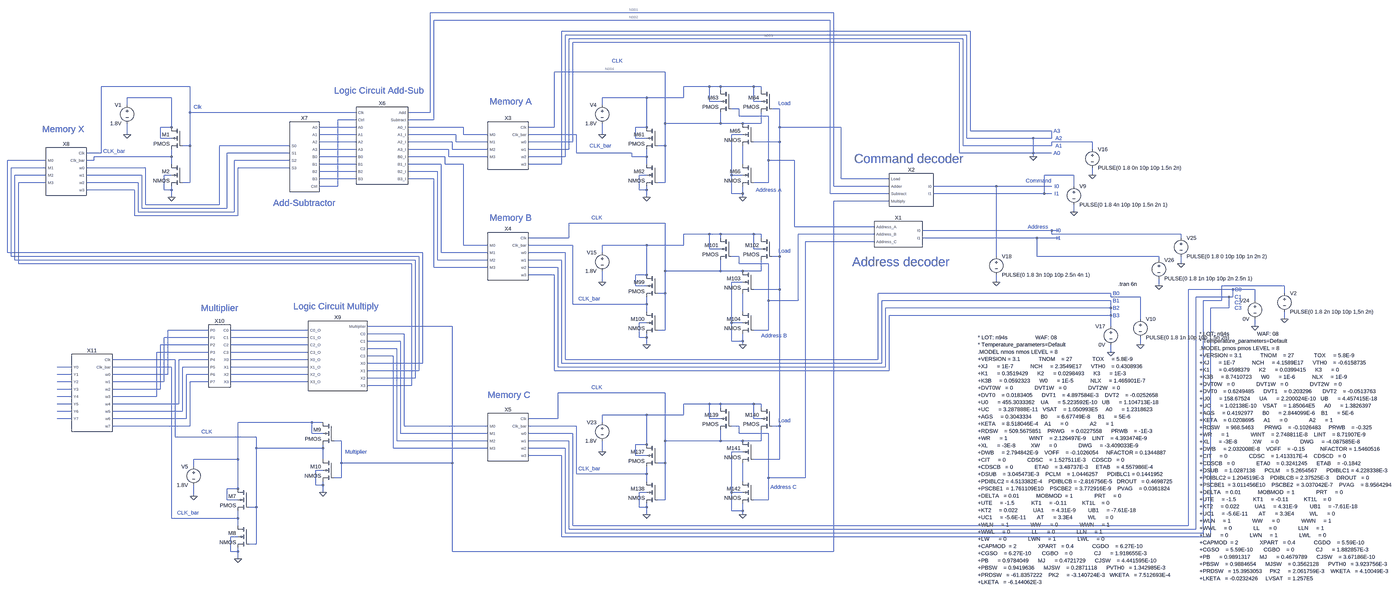
[diagram p0: schematic Ex5_Ex_Multiplier_Working_Simplified.asc, whole sheet]
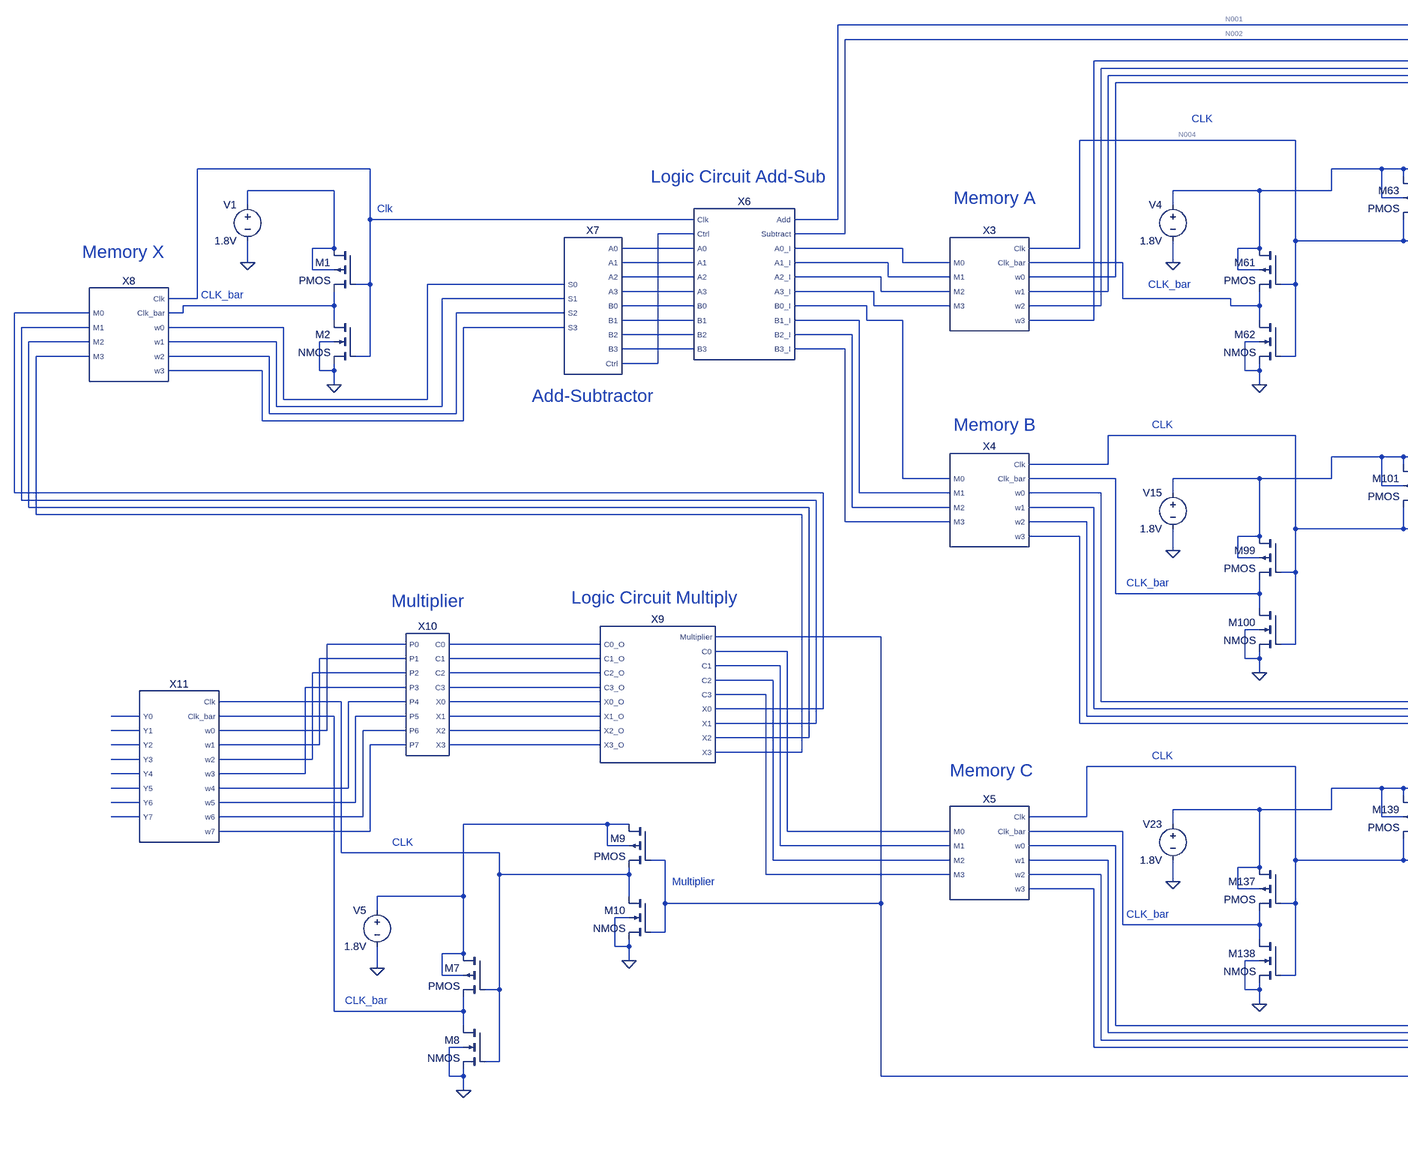
[diagram p1: schematic Ex5_Ex_Multiplier_Working_Simplified.asc, part, row 1 of 1, column 1 of 2]
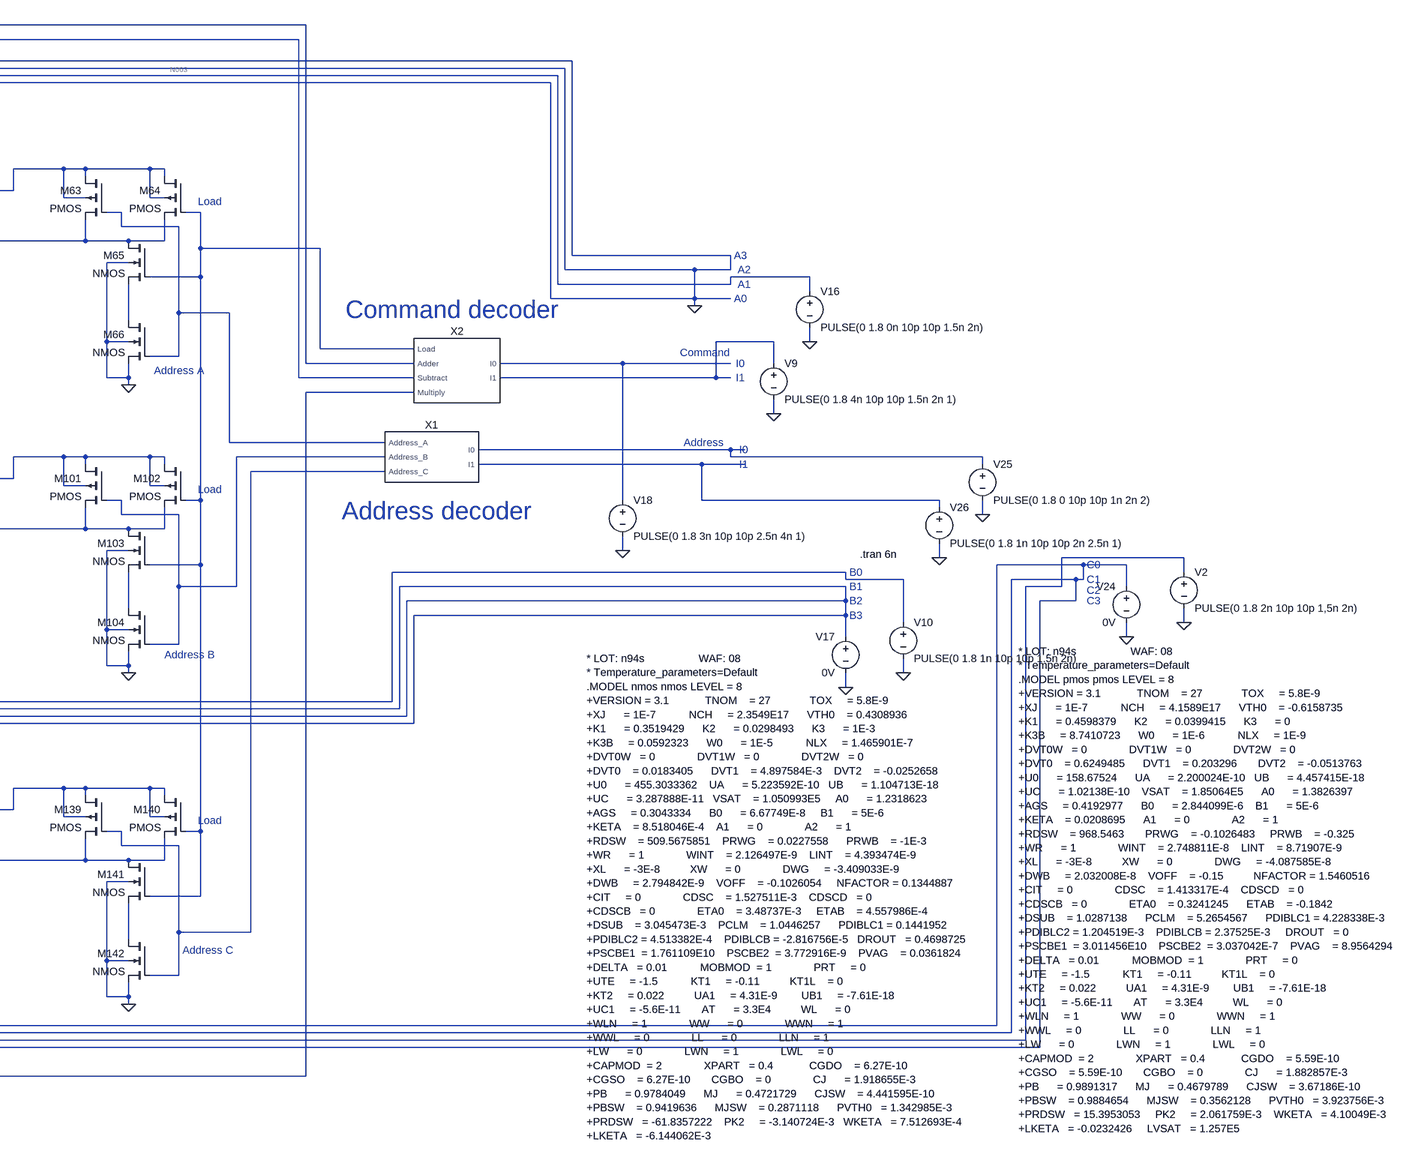
[diagram p2: schematic Ex5_Ex_Multiplier_Working_Simplified.asc, part, row 1 of 1, column 2 of 2]
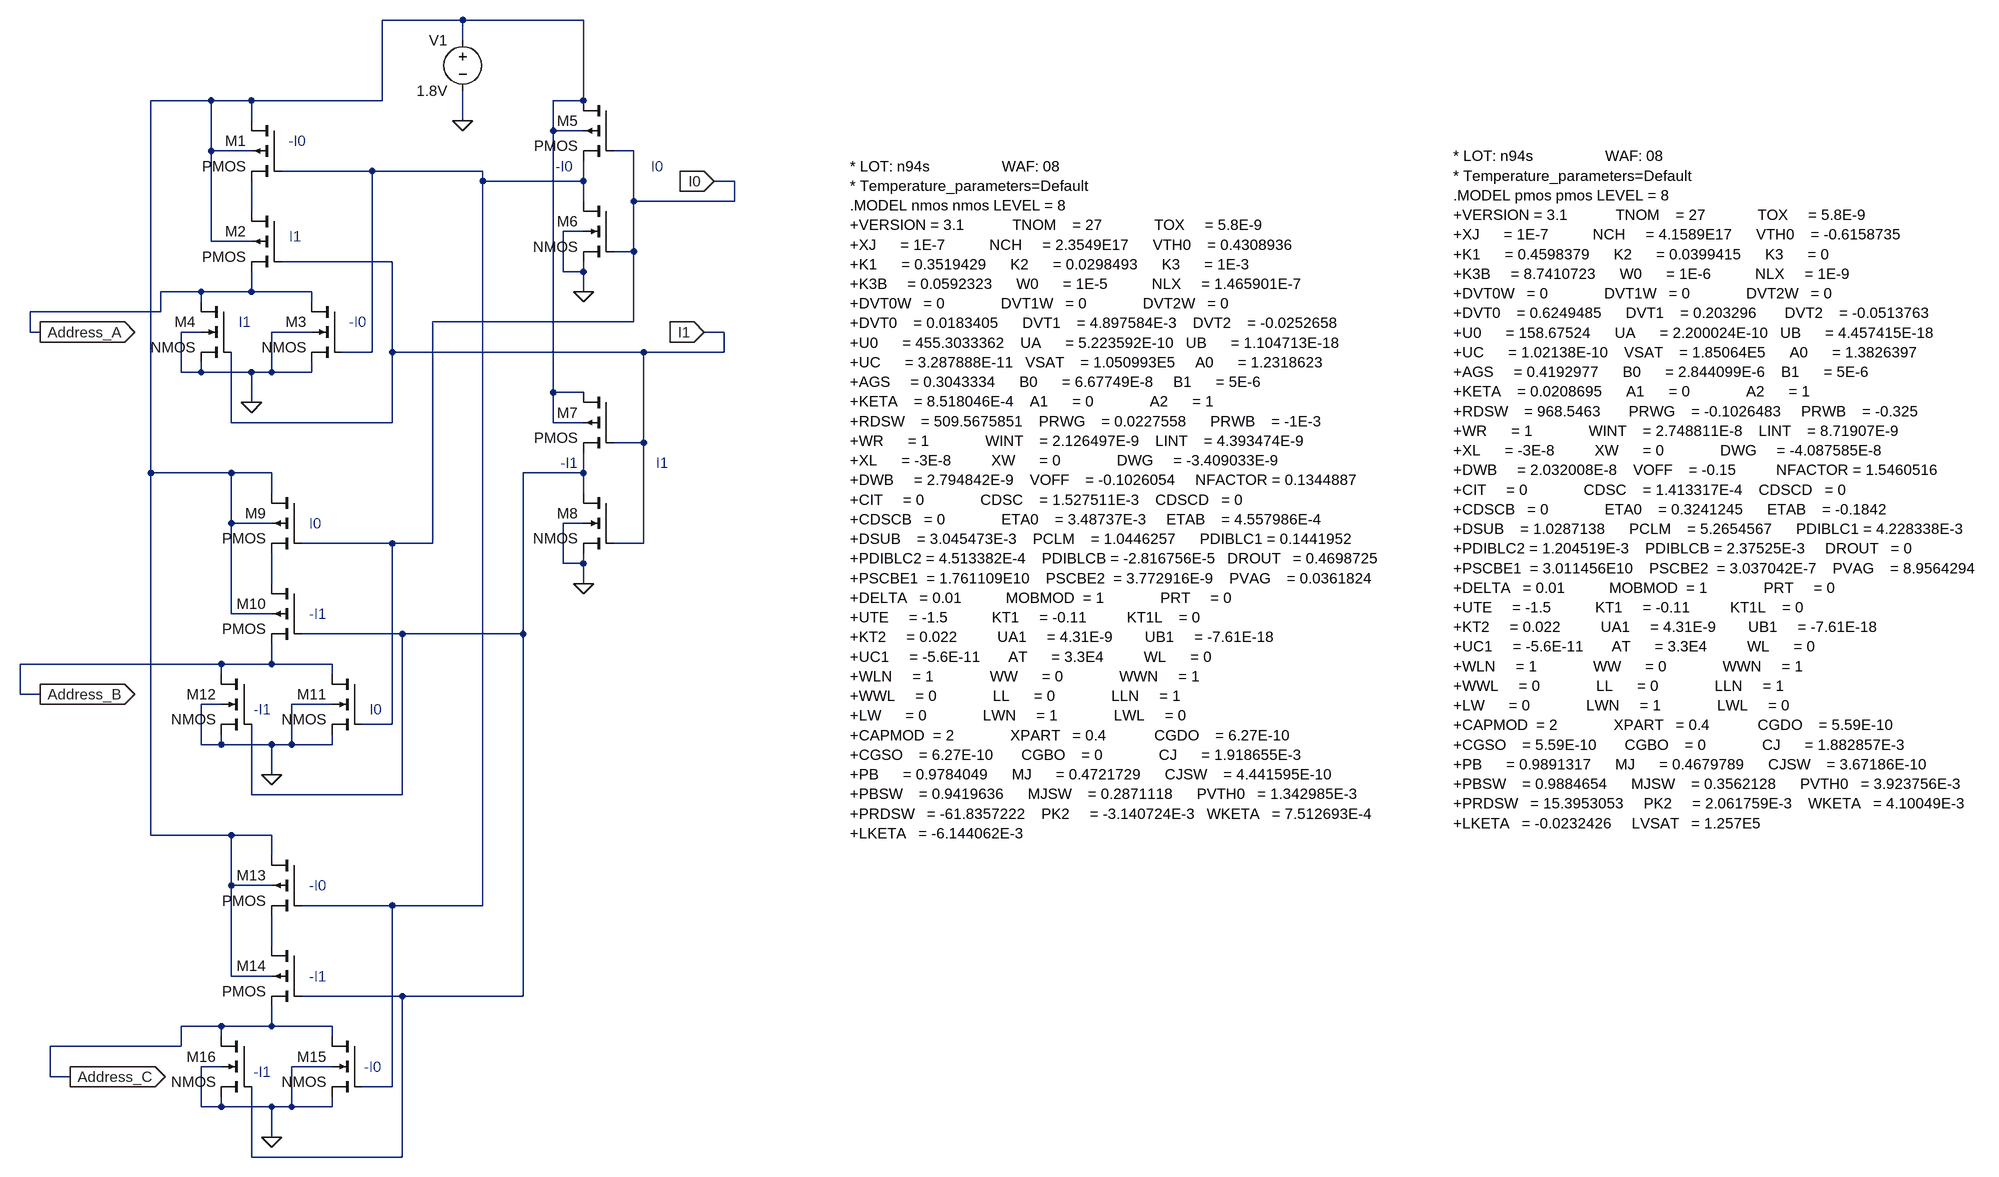
[diagram p3: sub-circuit address_decoder.asc]
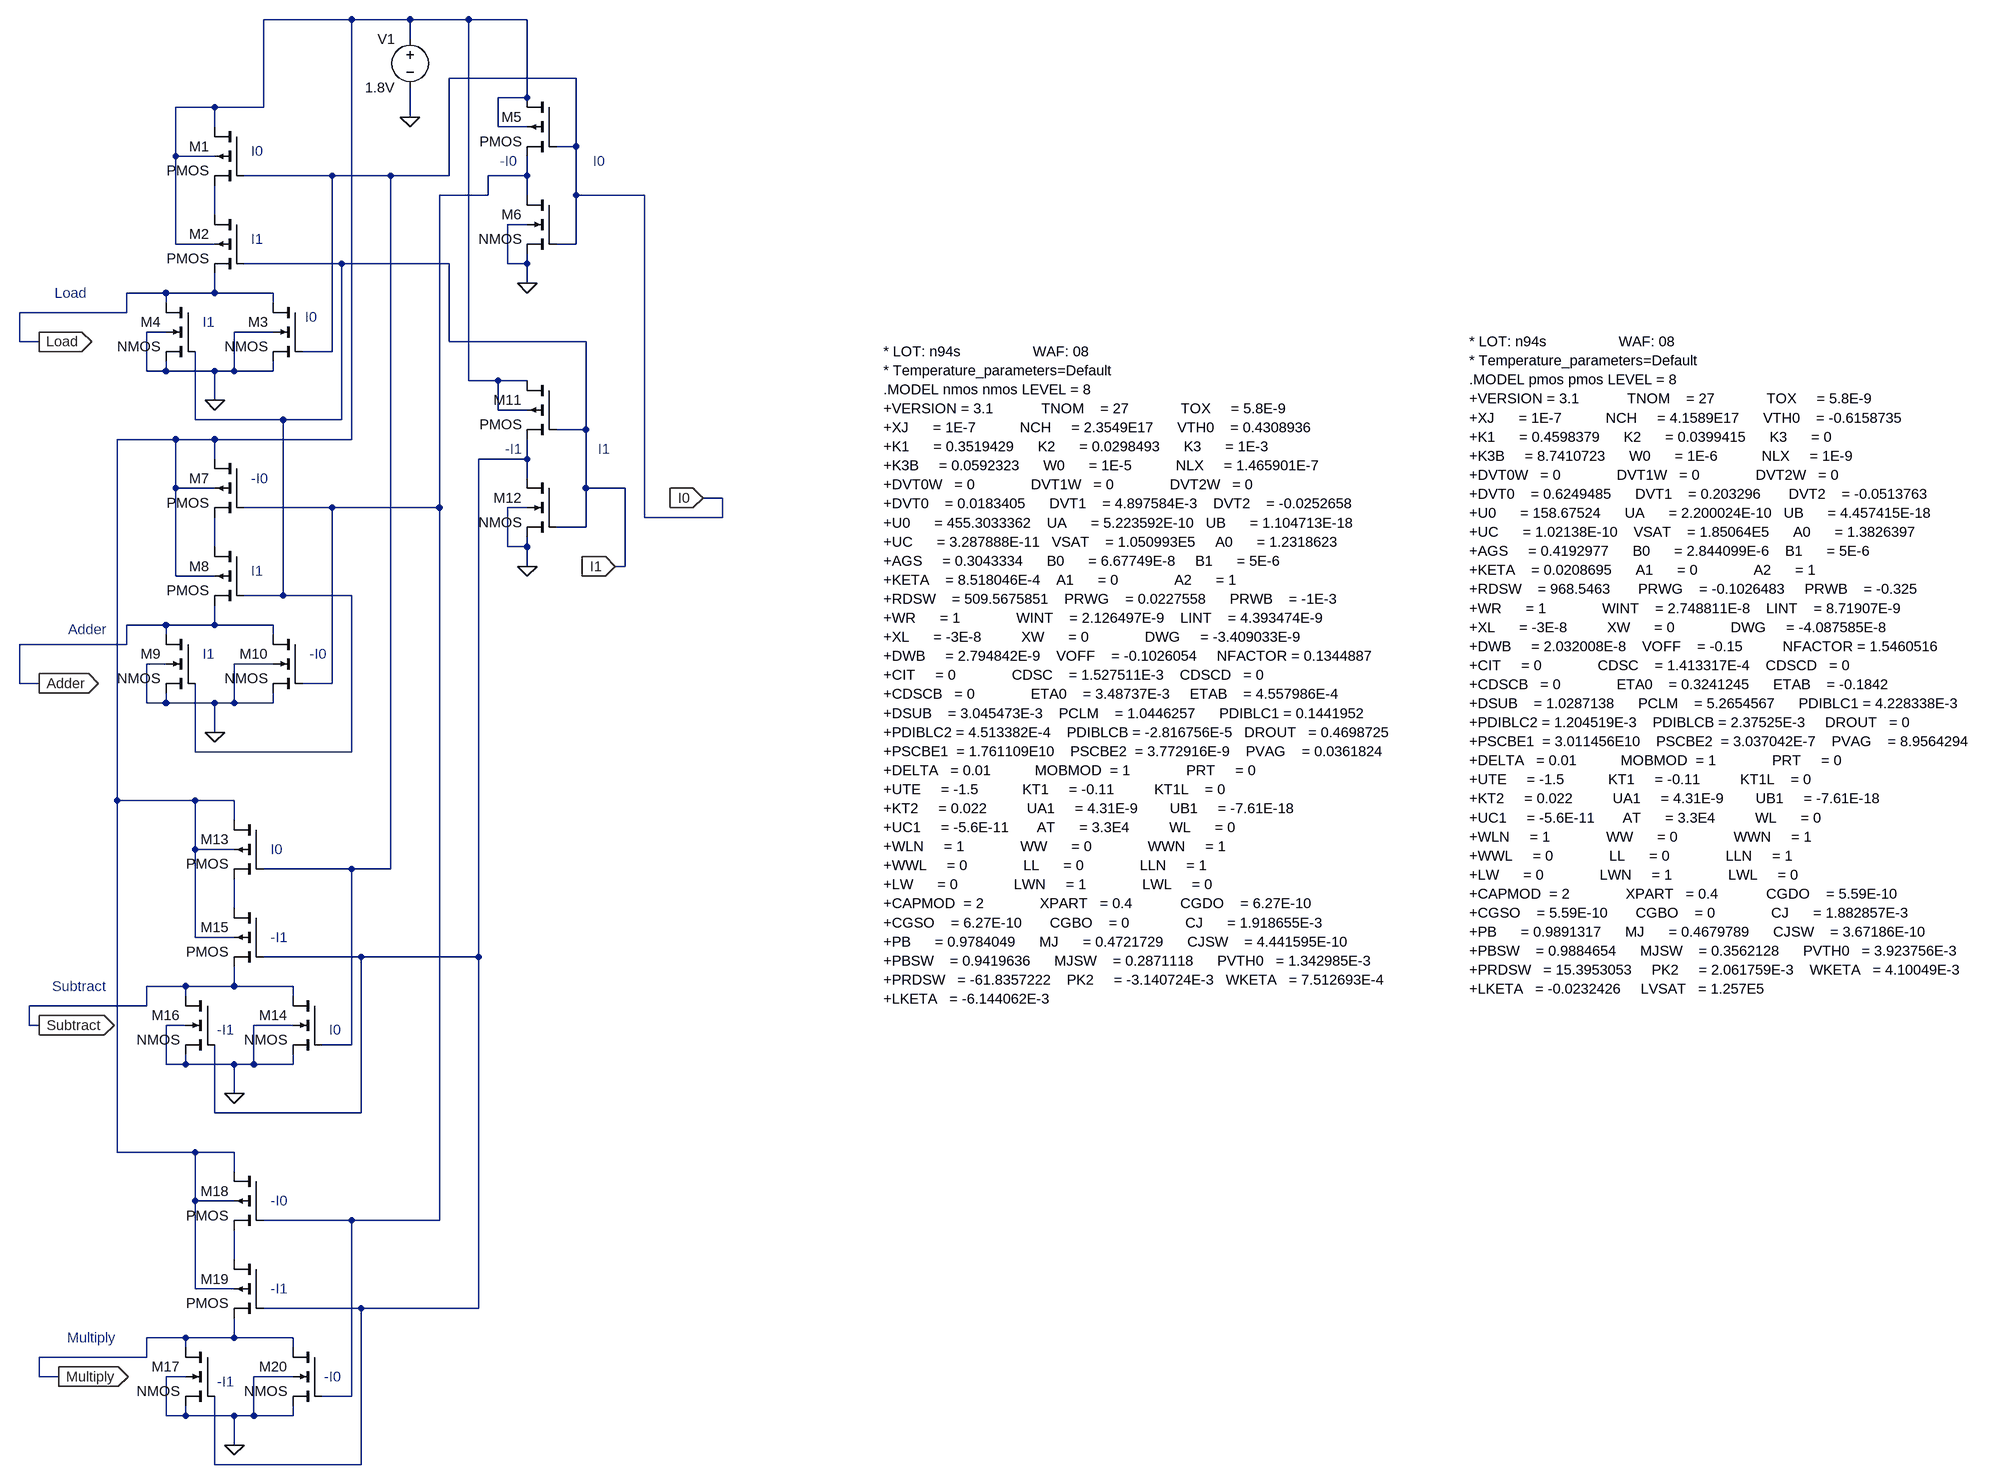
[diagram p4: sub-circuit command_decoder.asc]
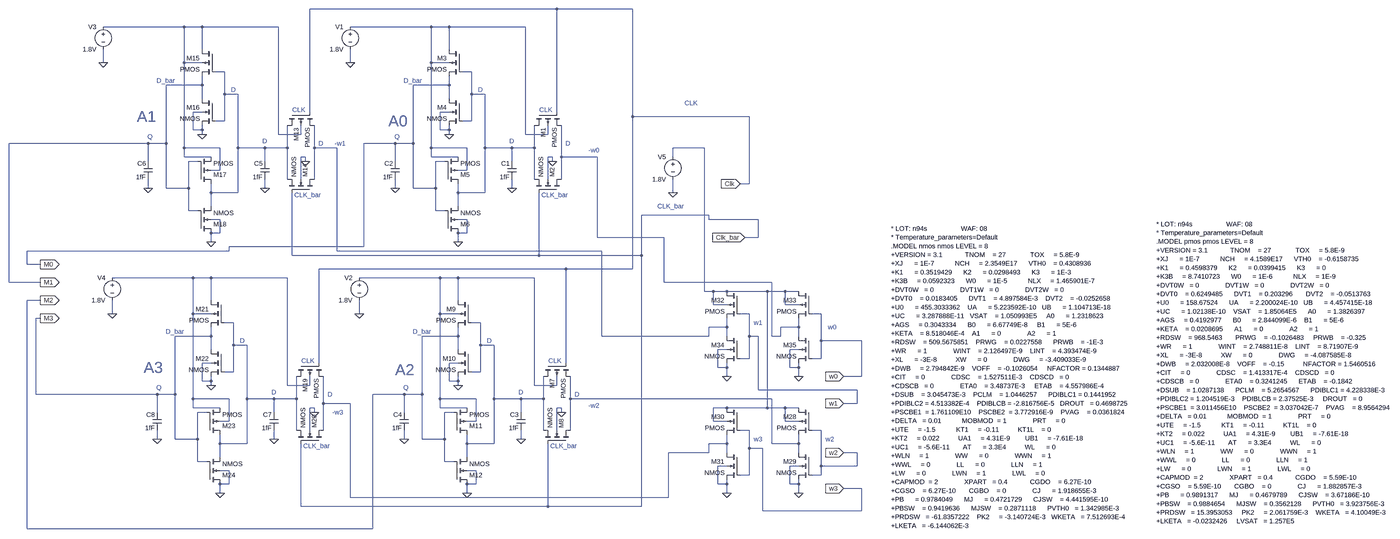
[diagram p5: sub-circuit 4-bit_memory.asc, whole sheet]
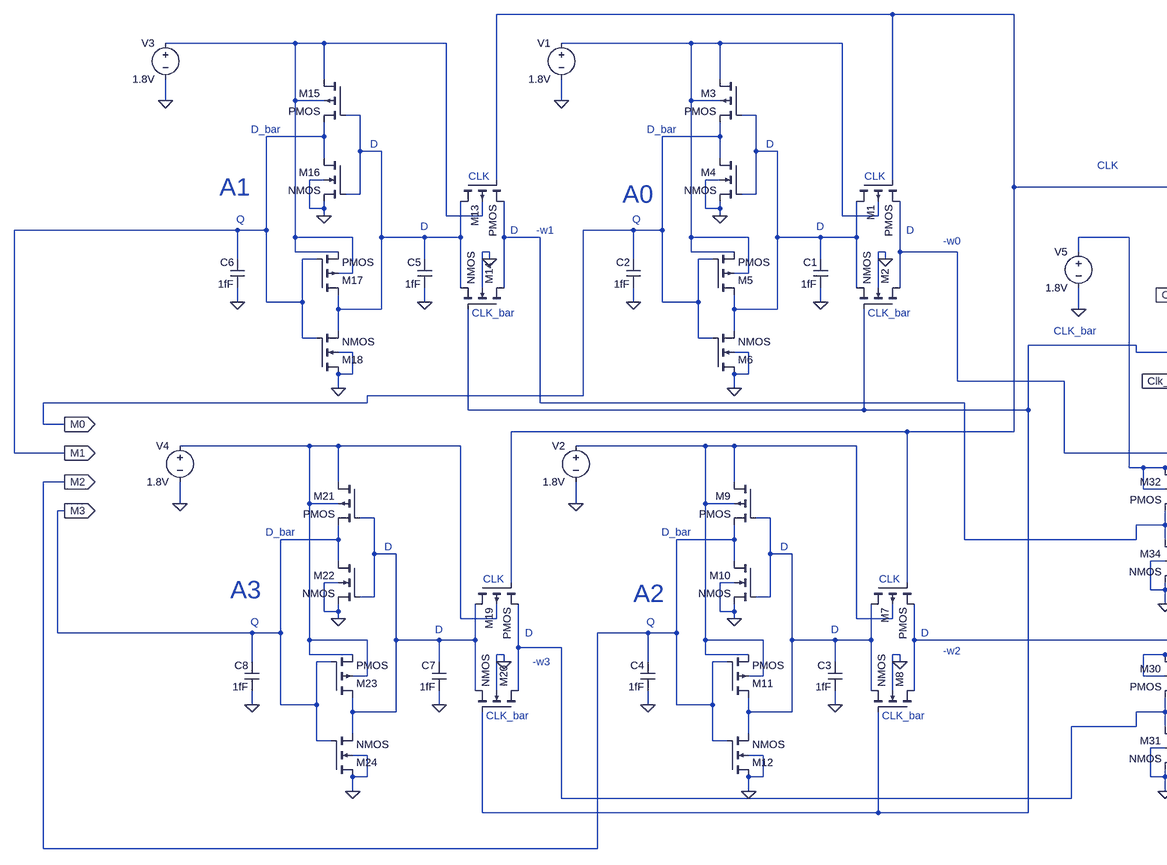
[diagram p6: sub-circuit 4-bit_memory.asc, part, row 1 of 1, column 1 of 2]
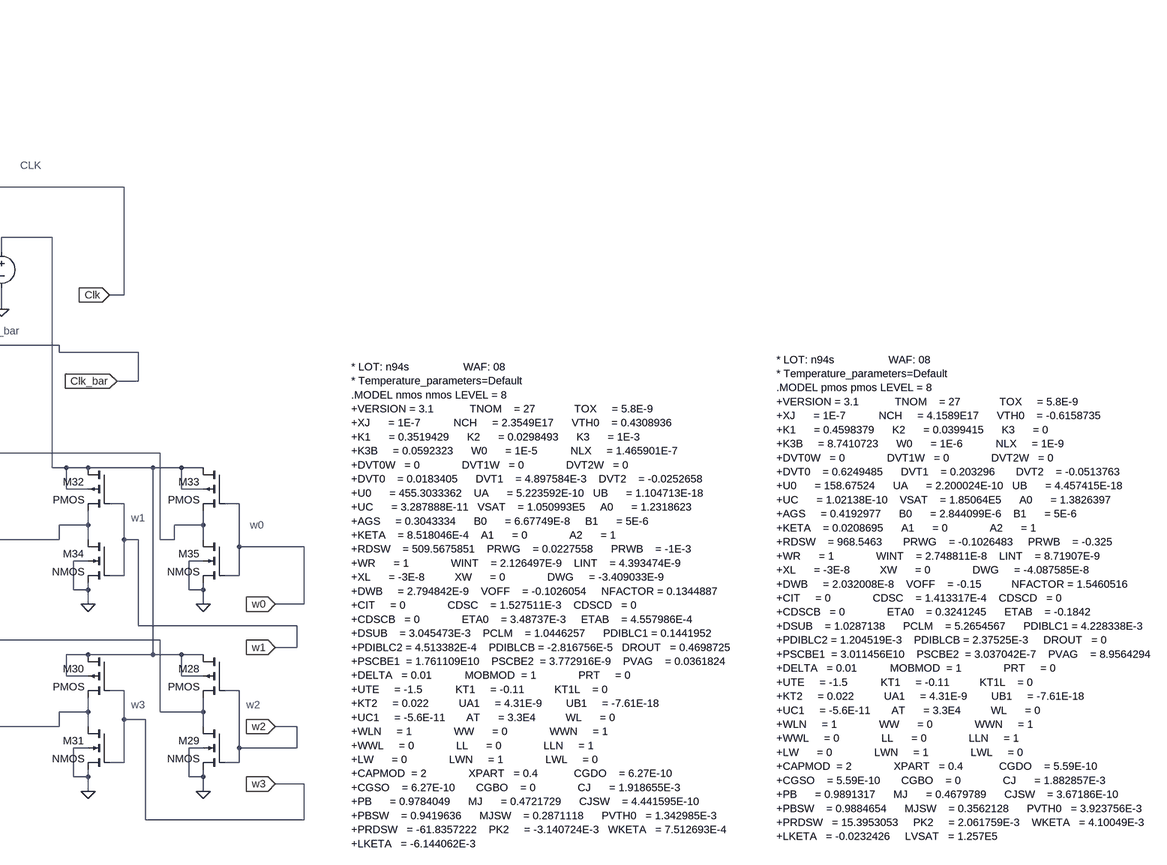
[diagram p7: sub-circuit 4-bit_memory.asc, part, row 1 of 1, column 2 of 2]
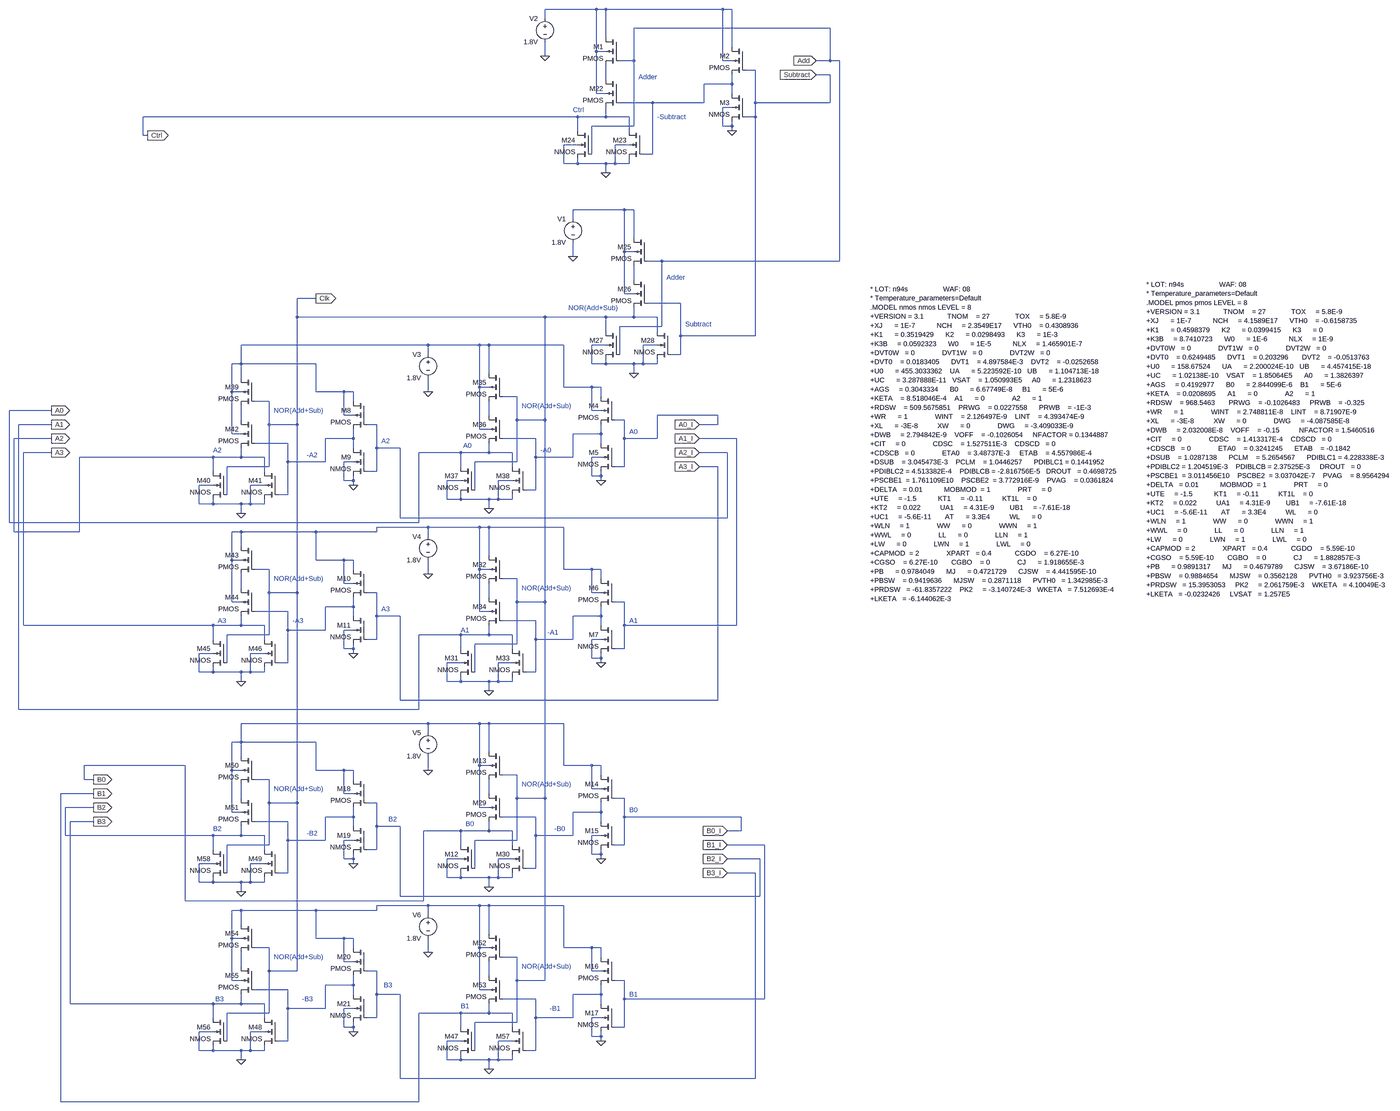
[diagram p8: sub-circuit logic_circuit_add-sub.asc, whole sheet]
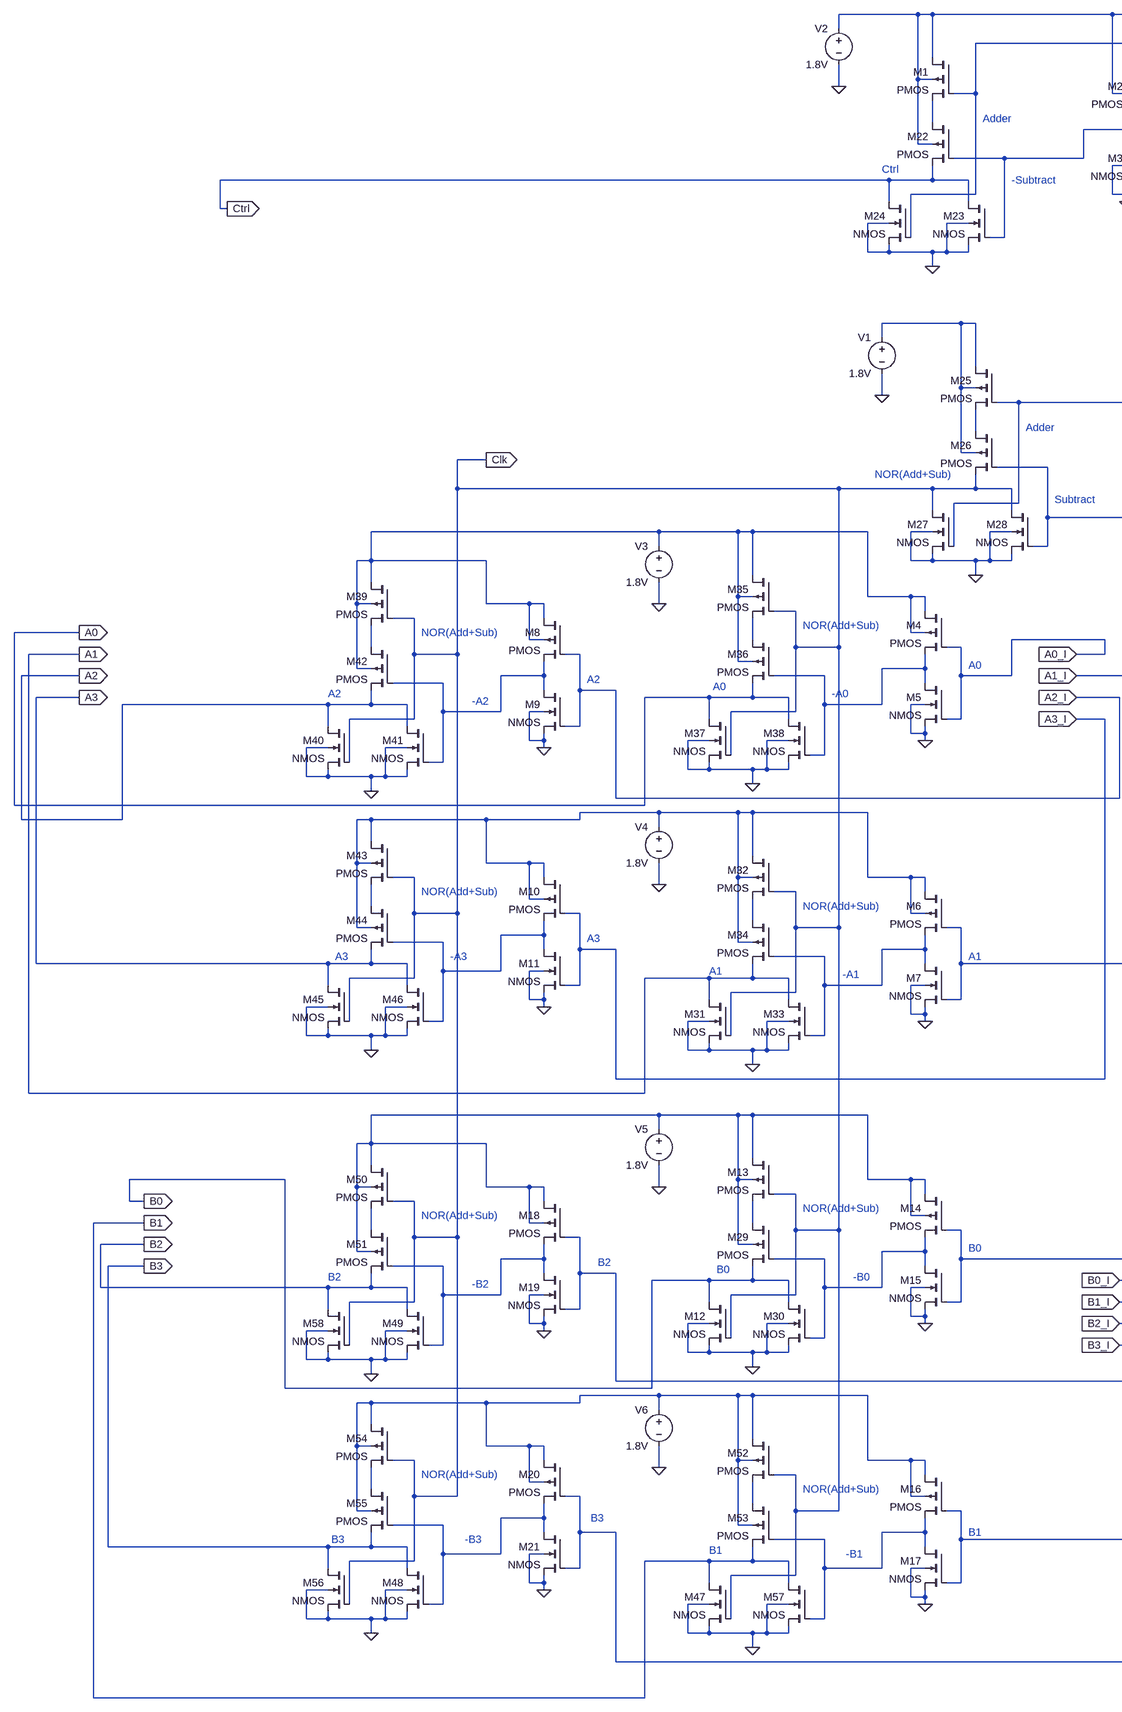
[diagram p9: sub-circuit logic_circuit_add-sub.asc, part, row 1 of 1, column 1 of 2]
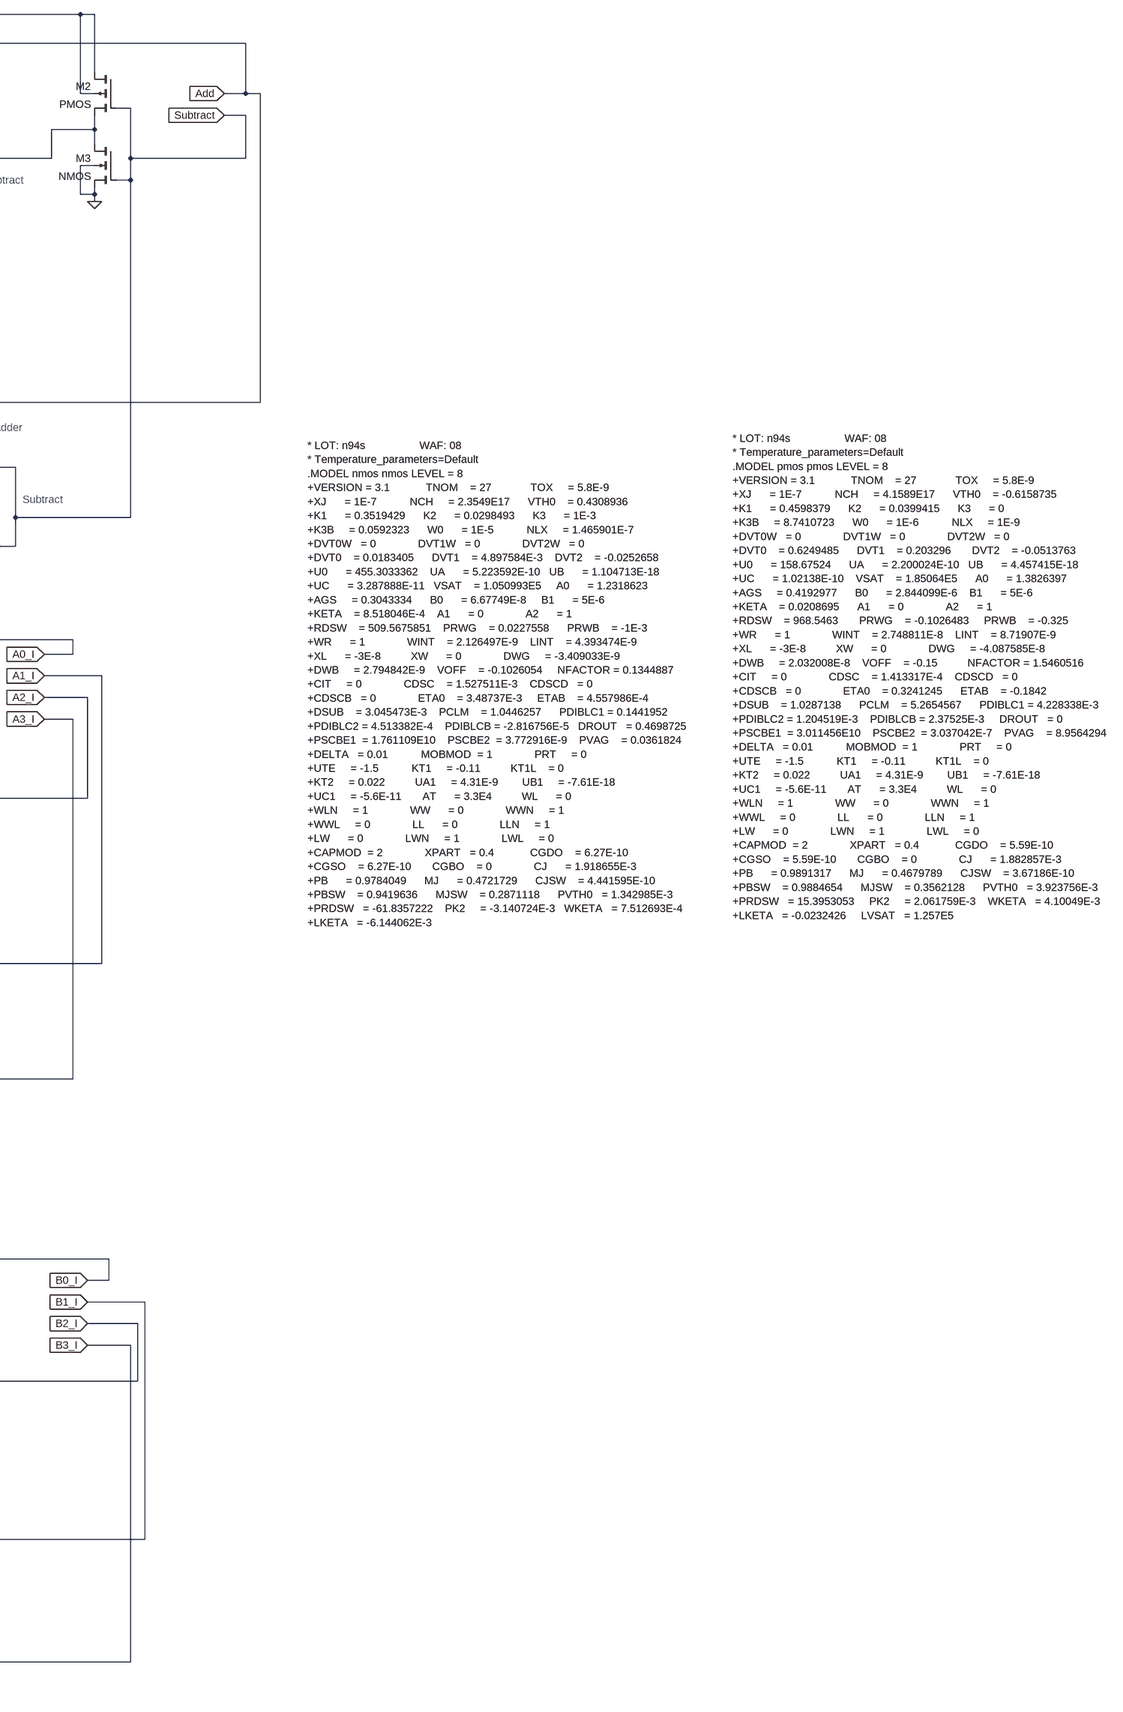
[diagram p10: sub-circuit logic_circuit_add-sub.asc, part, row 1 of 1, column 2 of 2]
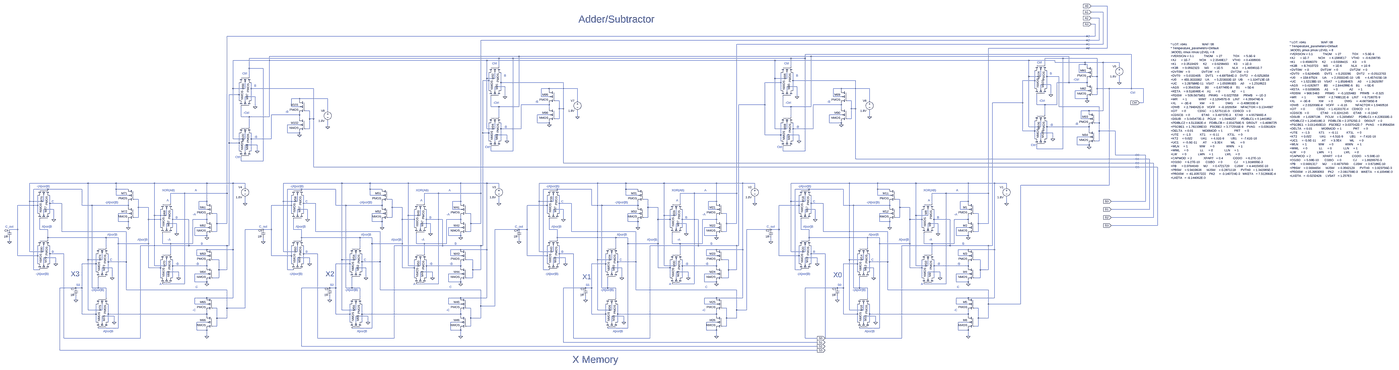
[diagram p11: sub-circuit adder_subtractor.asc, whole sheet]
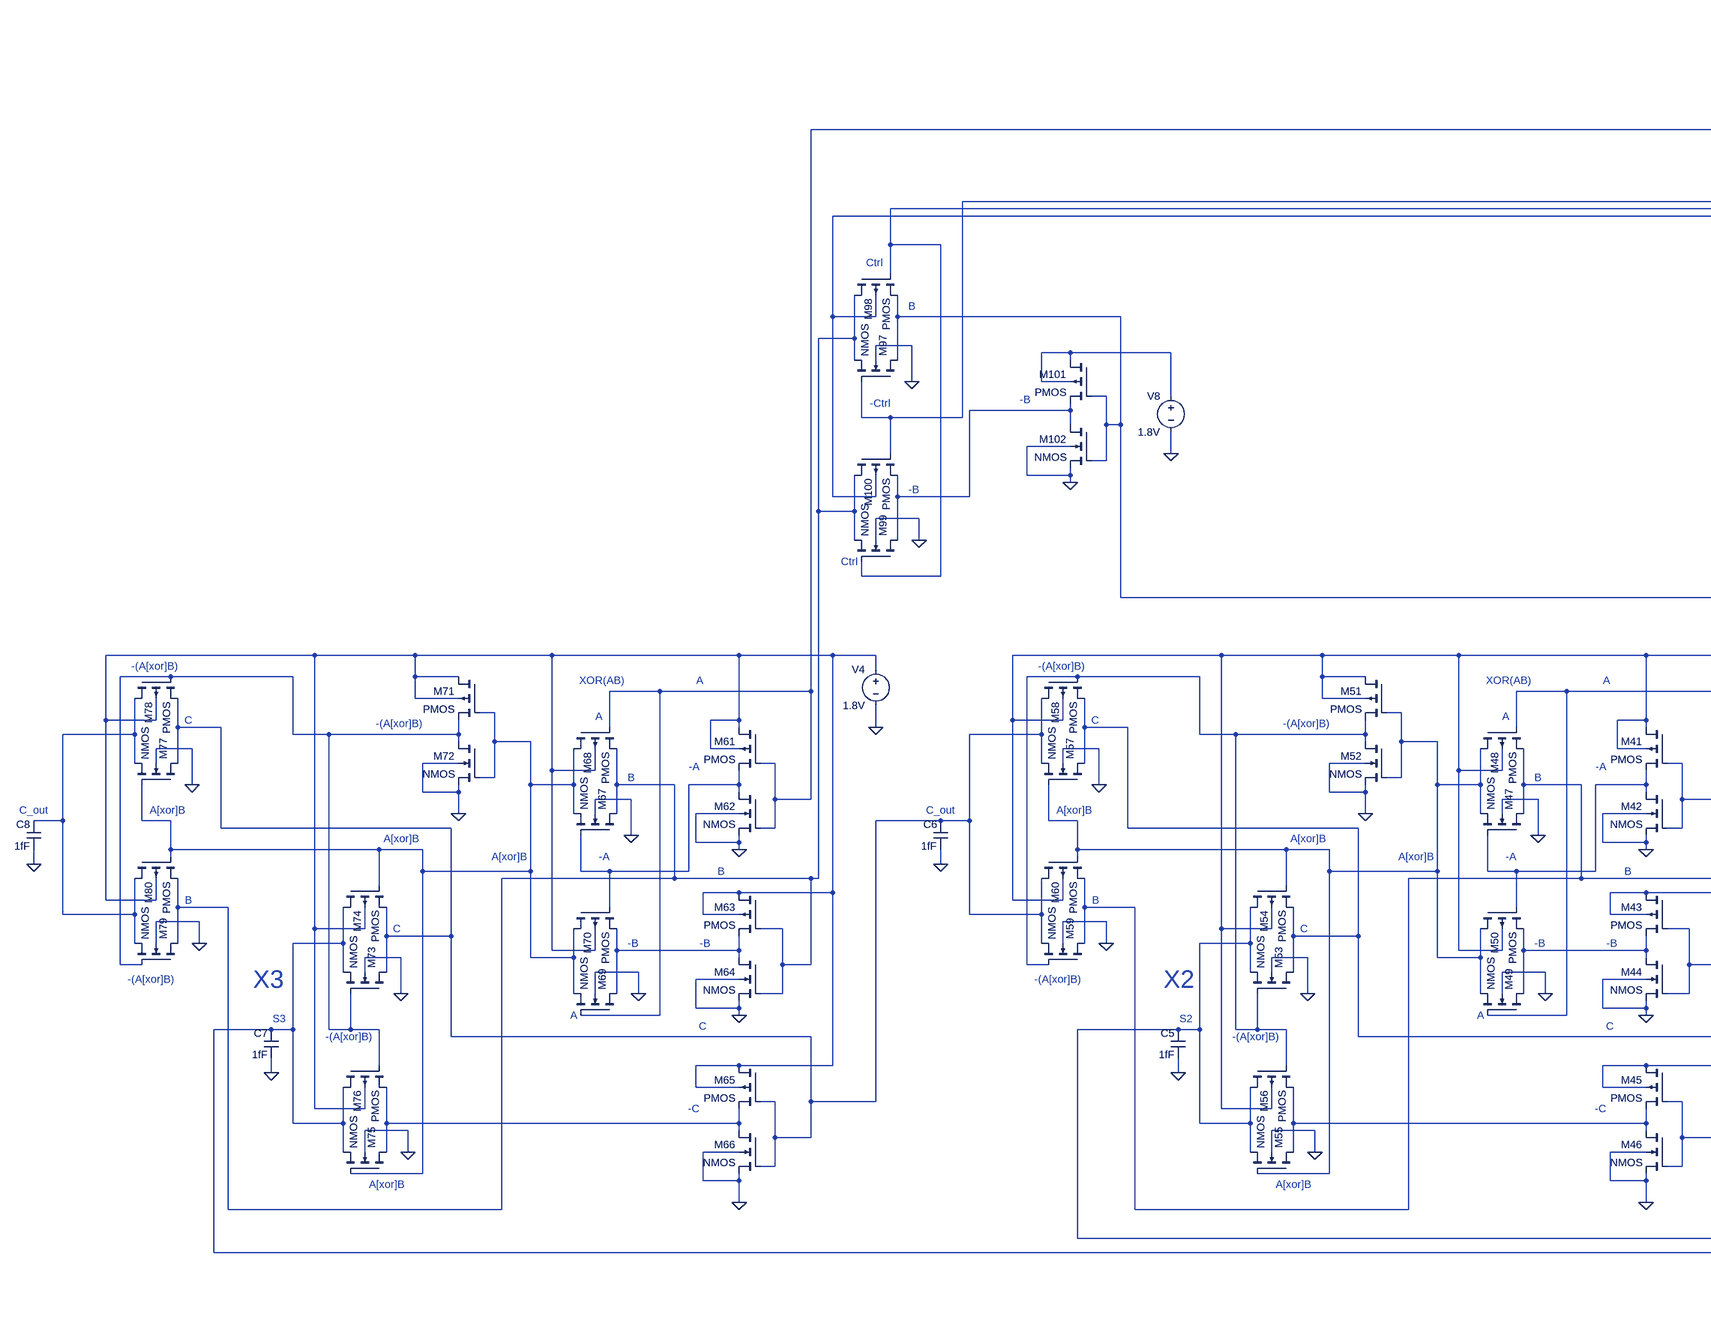
[diagram p12: sub-circuit adder_subtractor.asc, part, row 1 of 1, column 1 of 3]
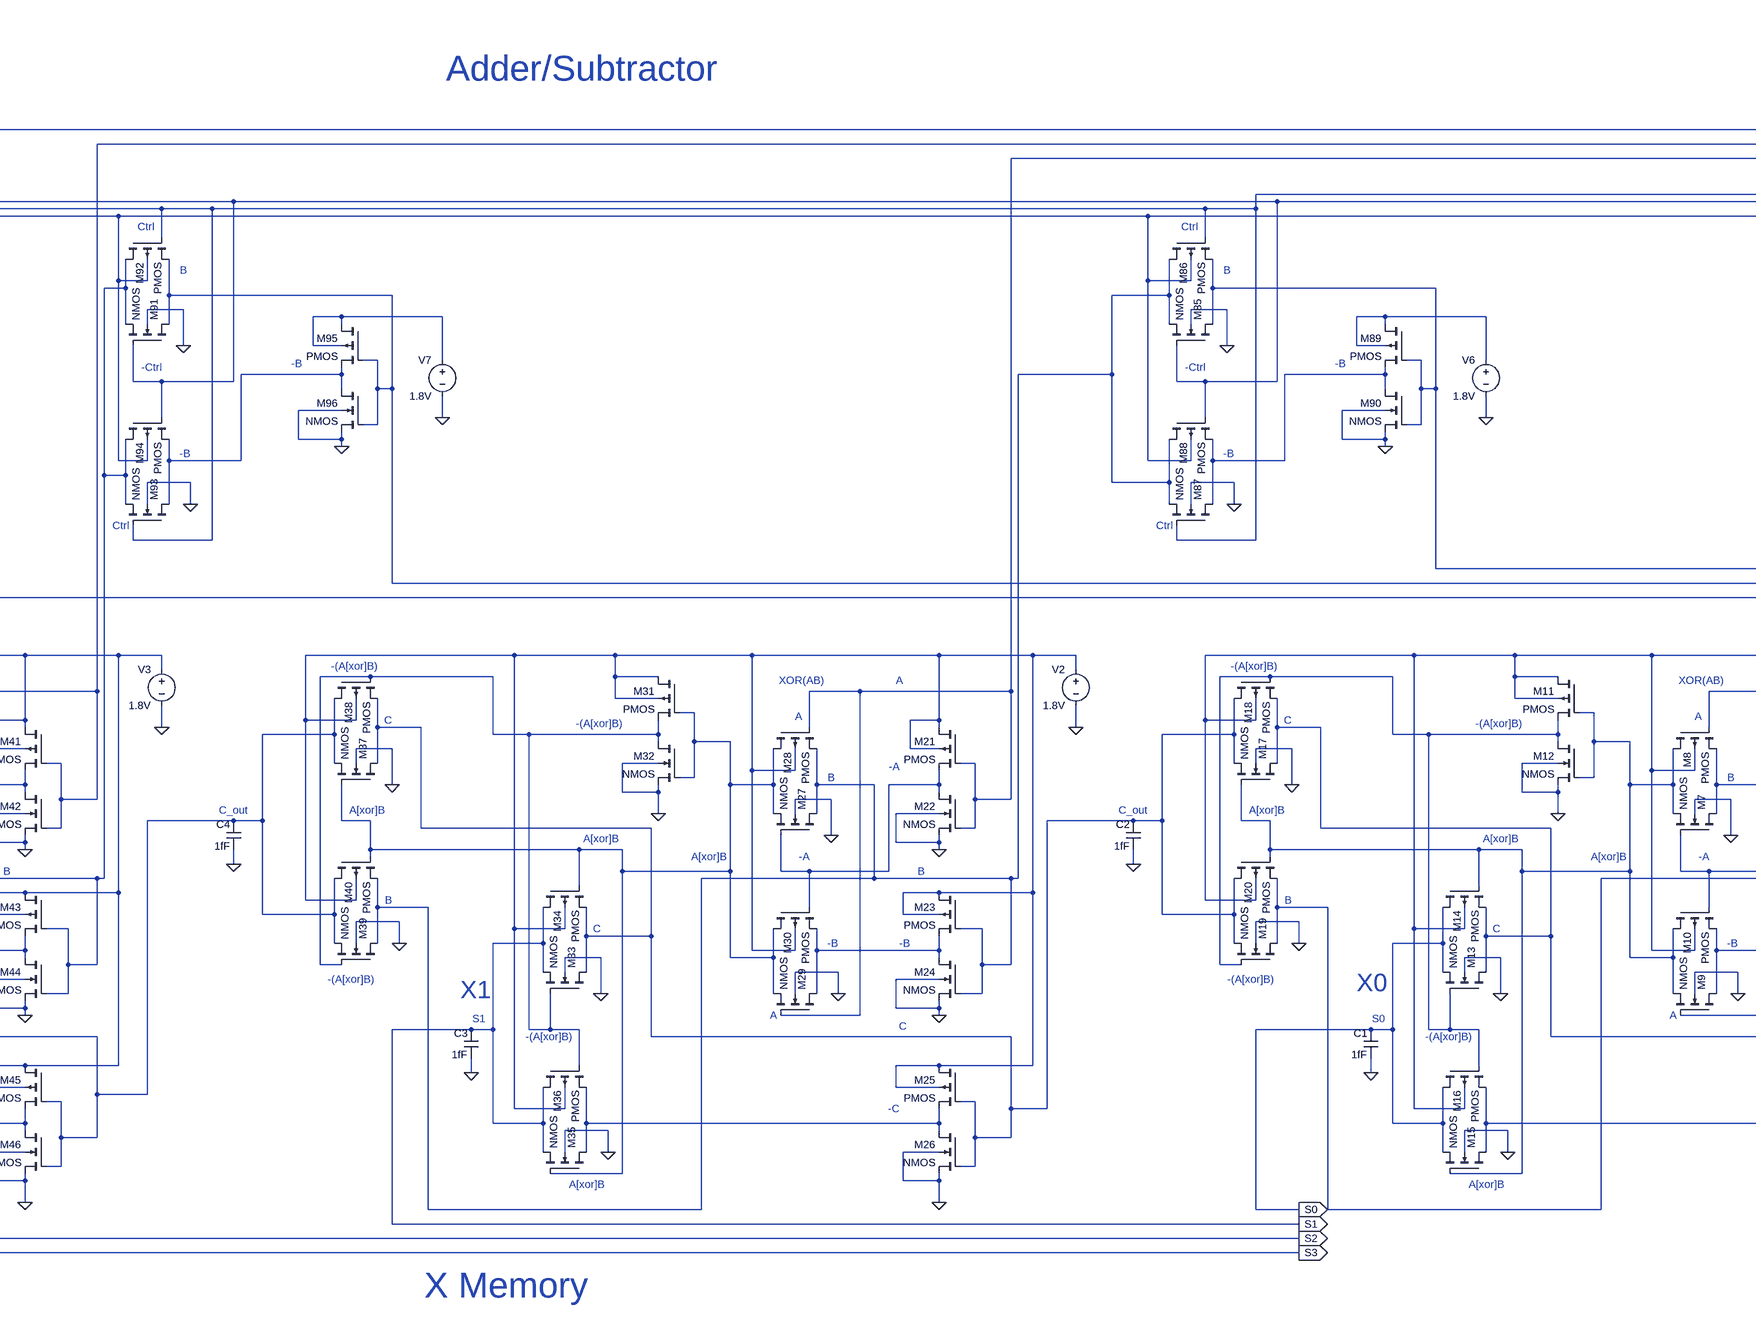
[diagram p13: sub-circuit adder_subtractor.asc, part, row 1 of 1, column 2 of 3]
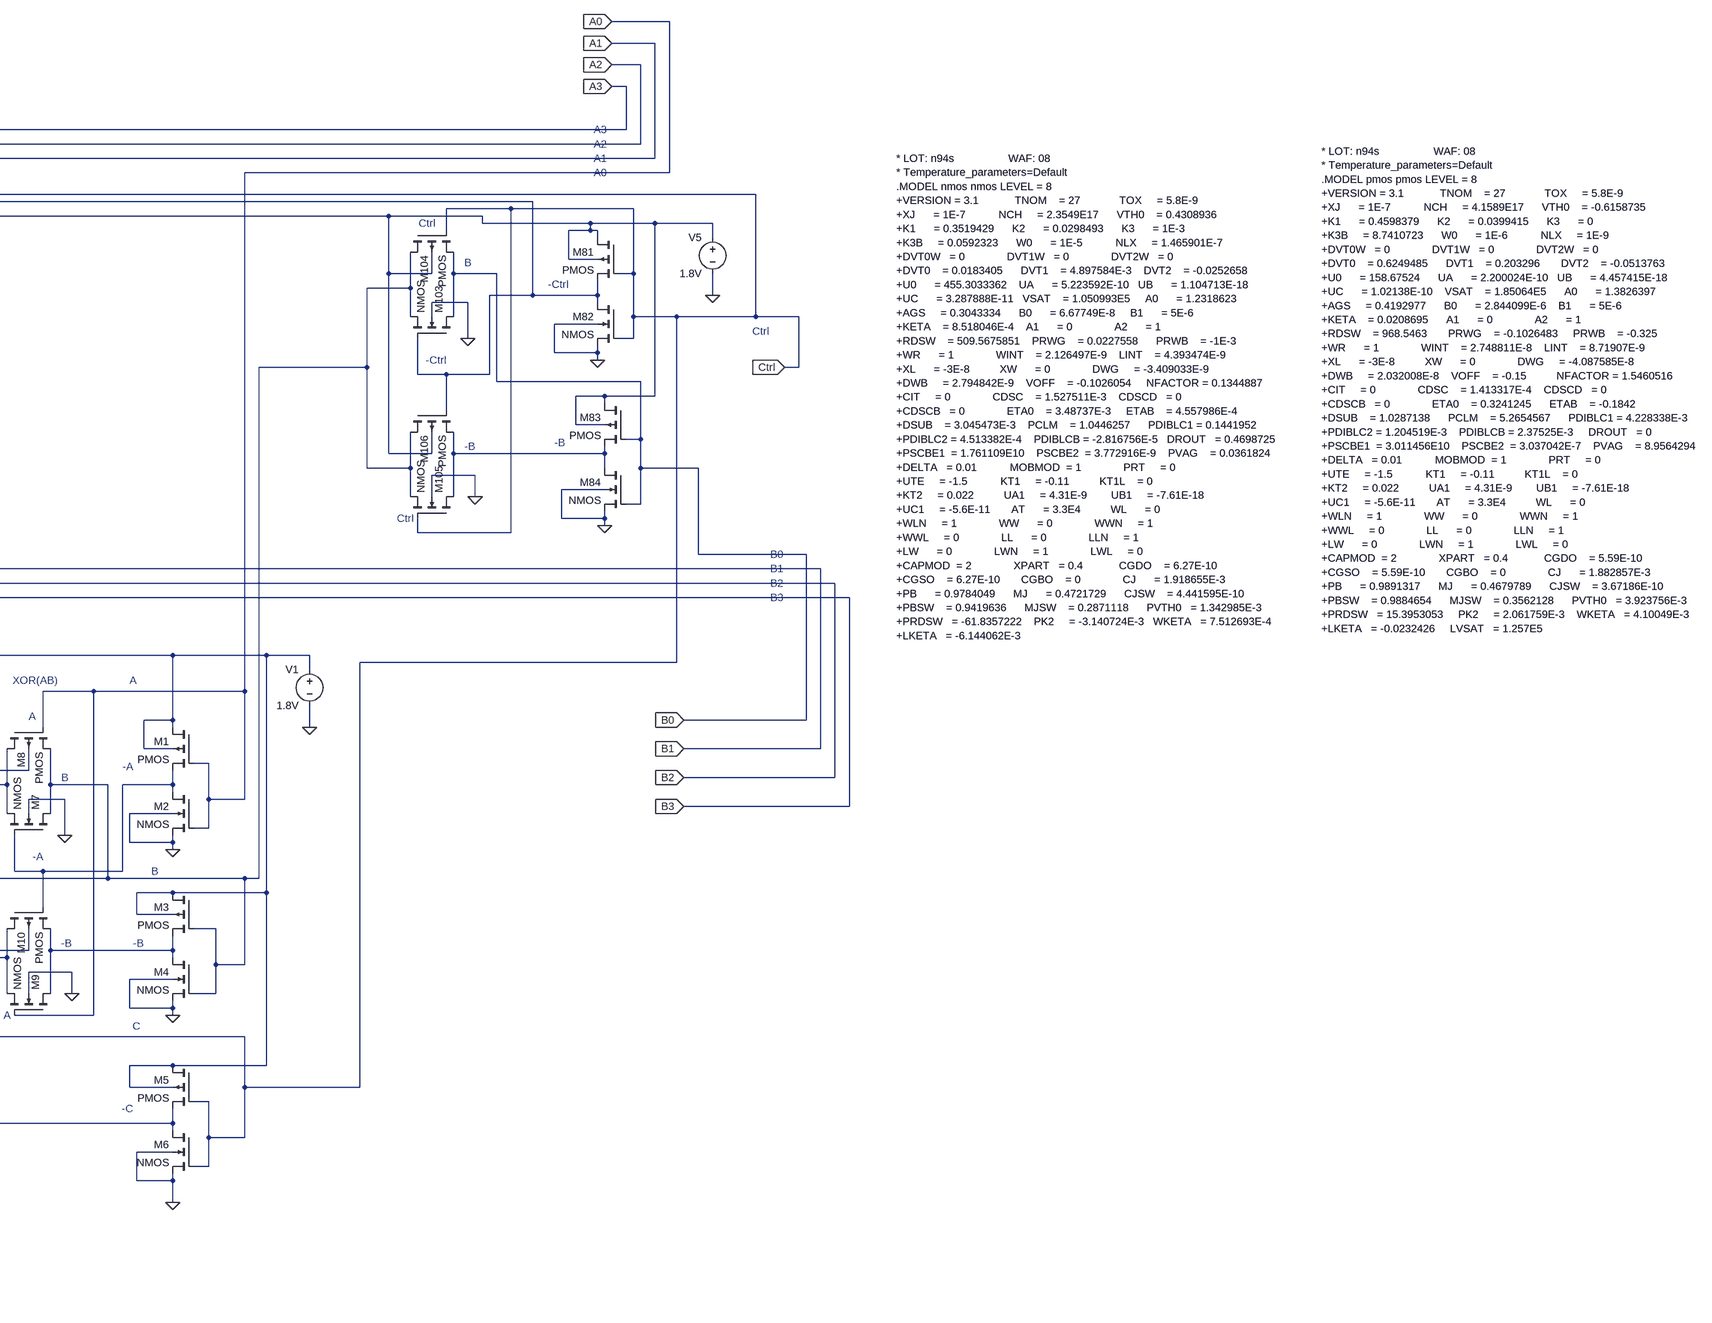
[diagram p14: sub-circuit adder_subtractor.asc, part, row 1 of 1, column 3 of 3]
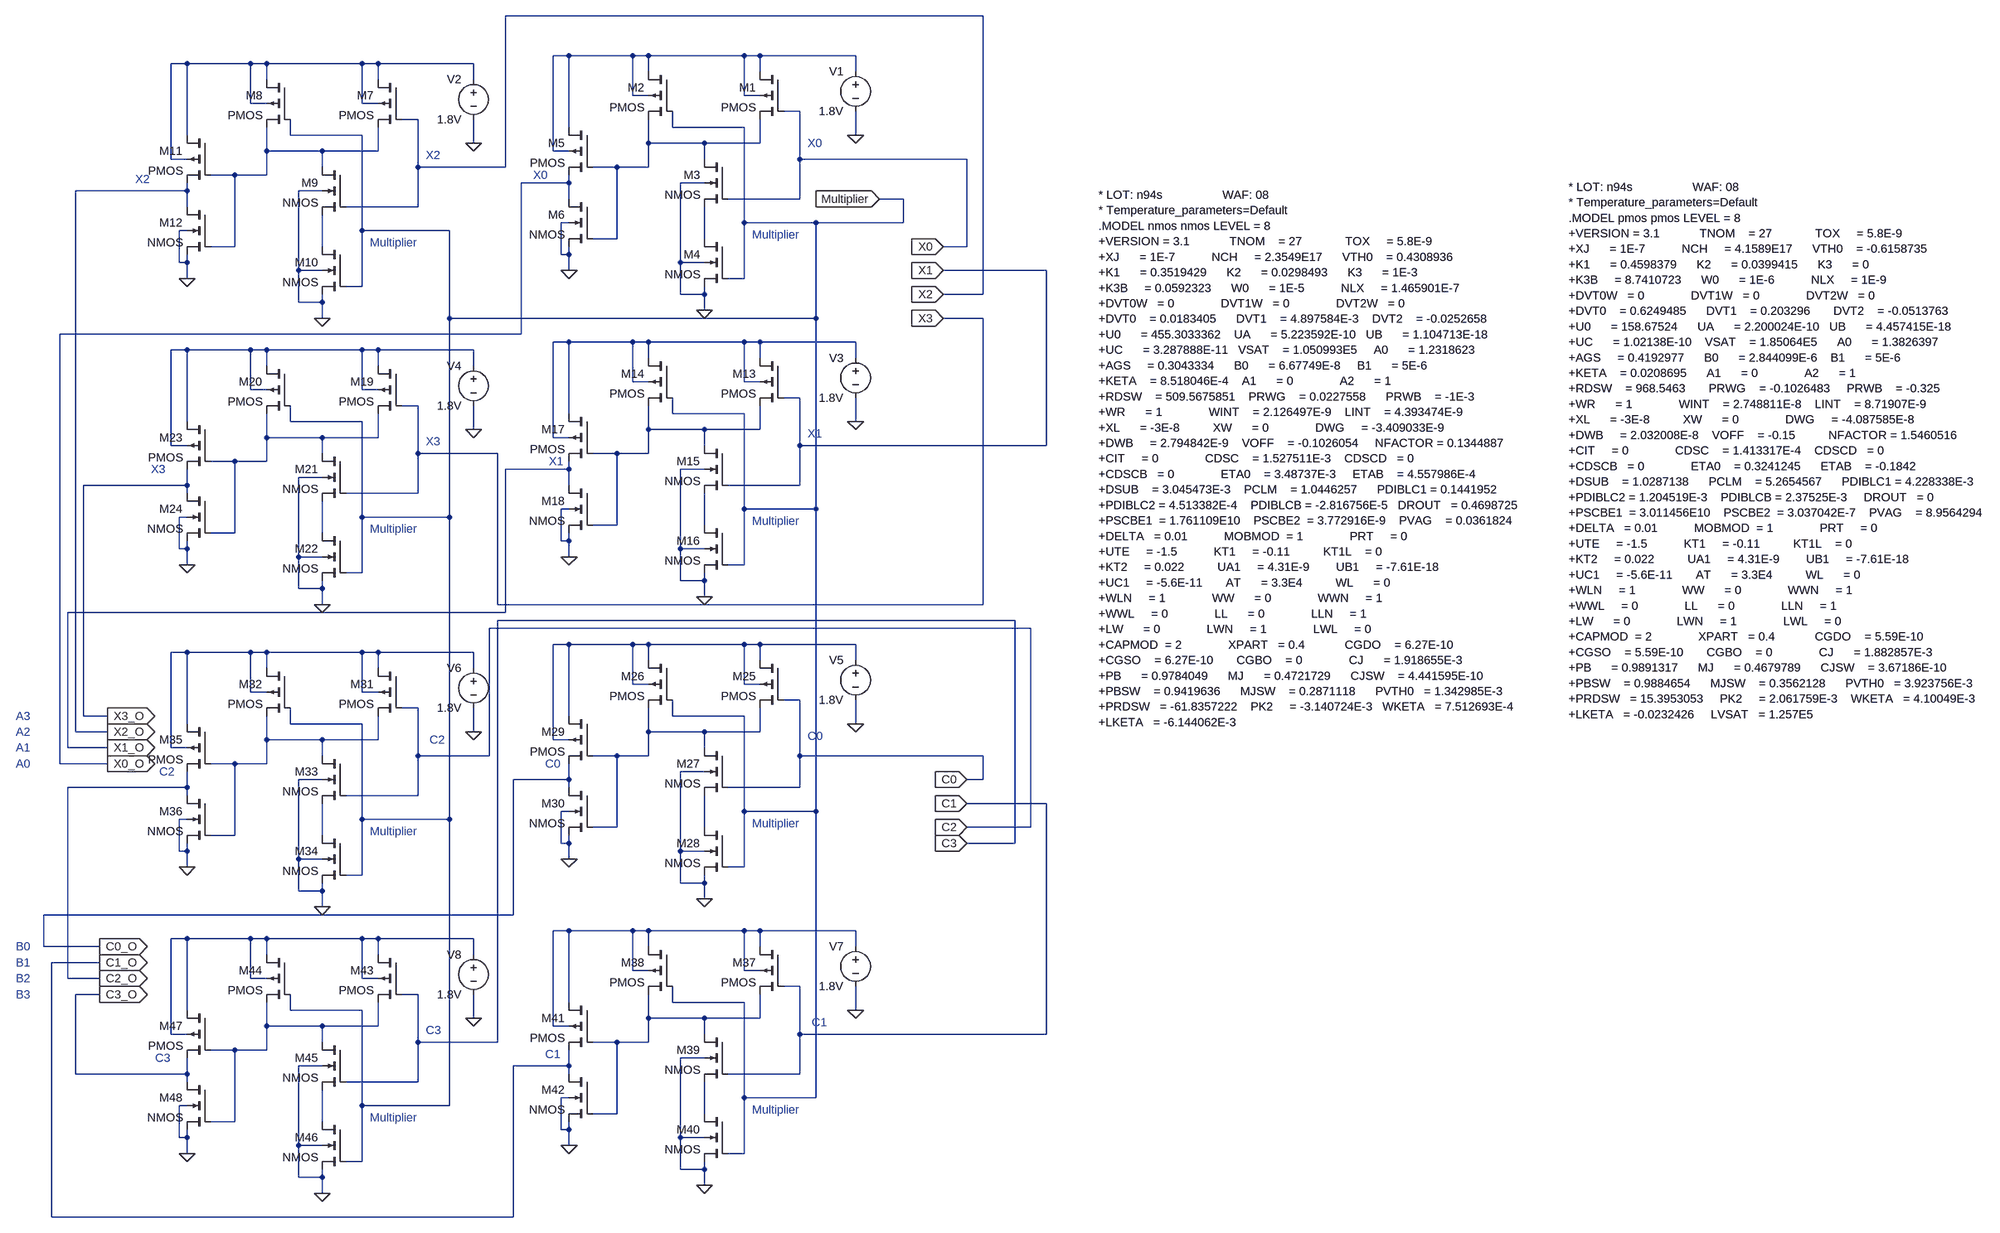
[diagram p15: sub-circuit logic_circuit_multiply.asc]
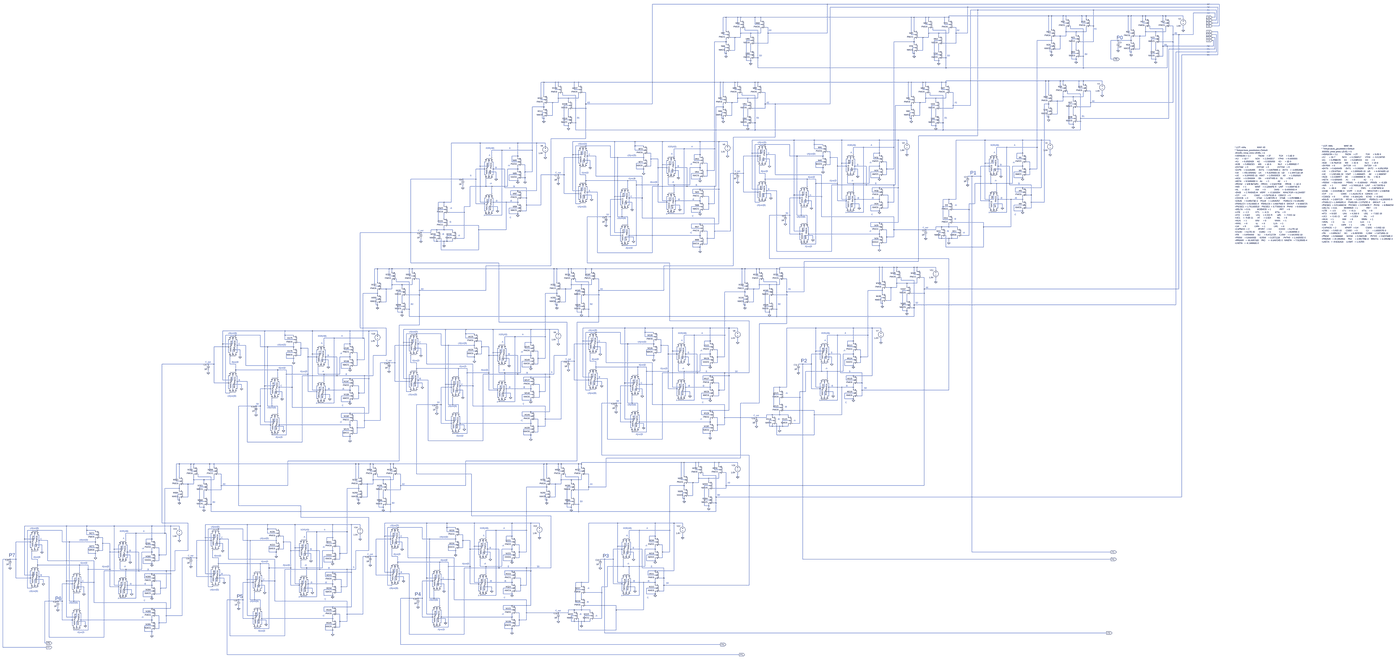
[diagram p16: sub-circuit multiplier.asc, whole sheet]
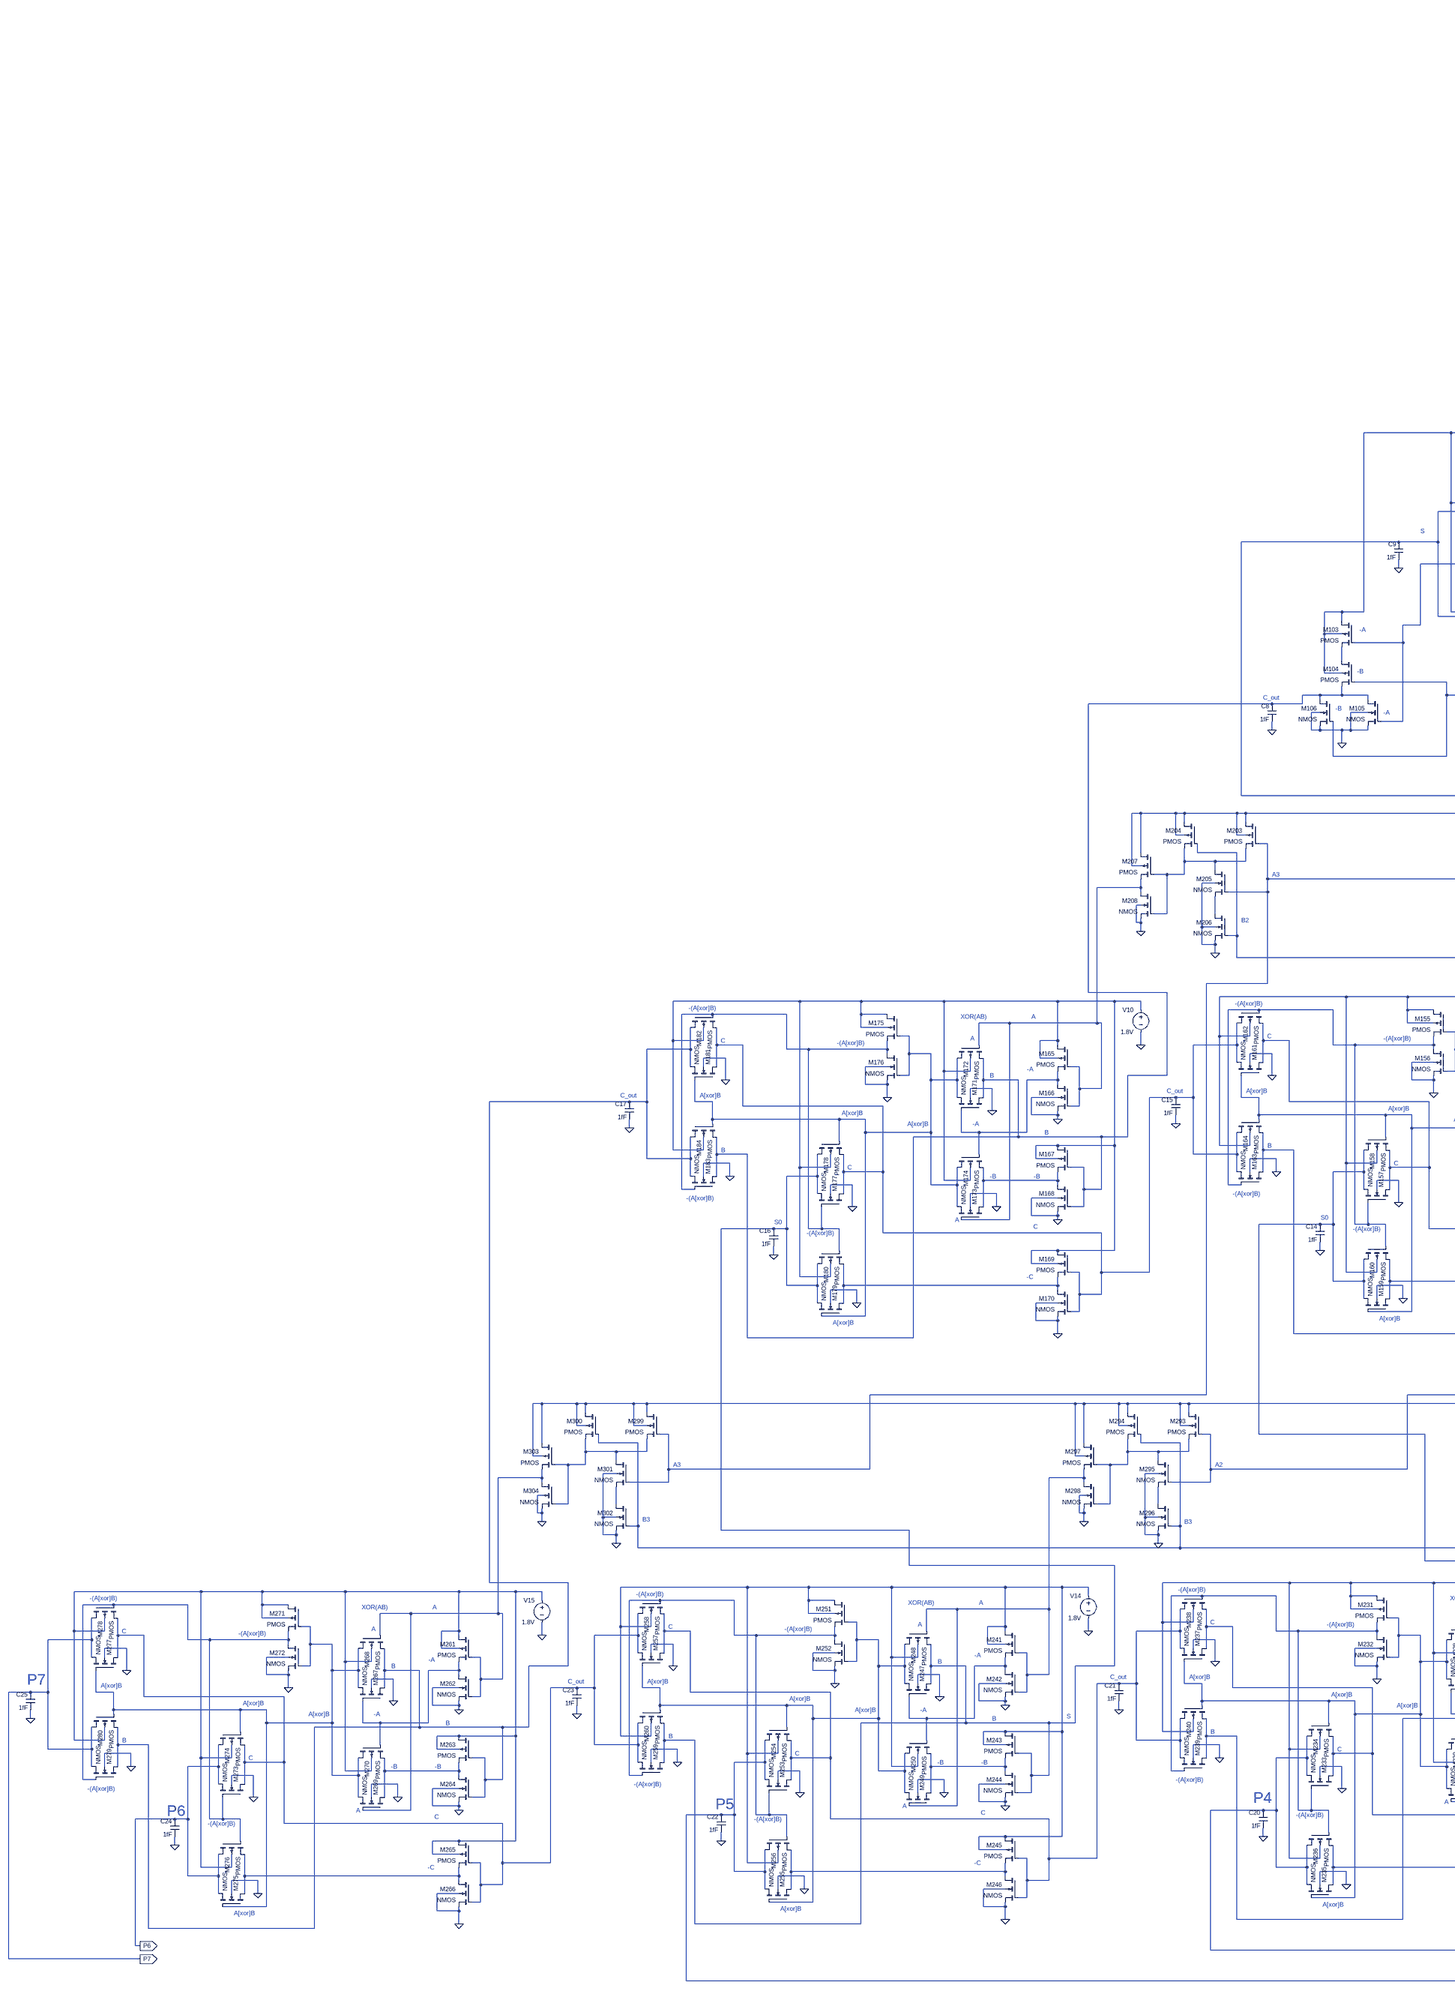
[diagram p17: sub-circuit multiplier.asc, part, row 1 of 1, column 1 of 3]
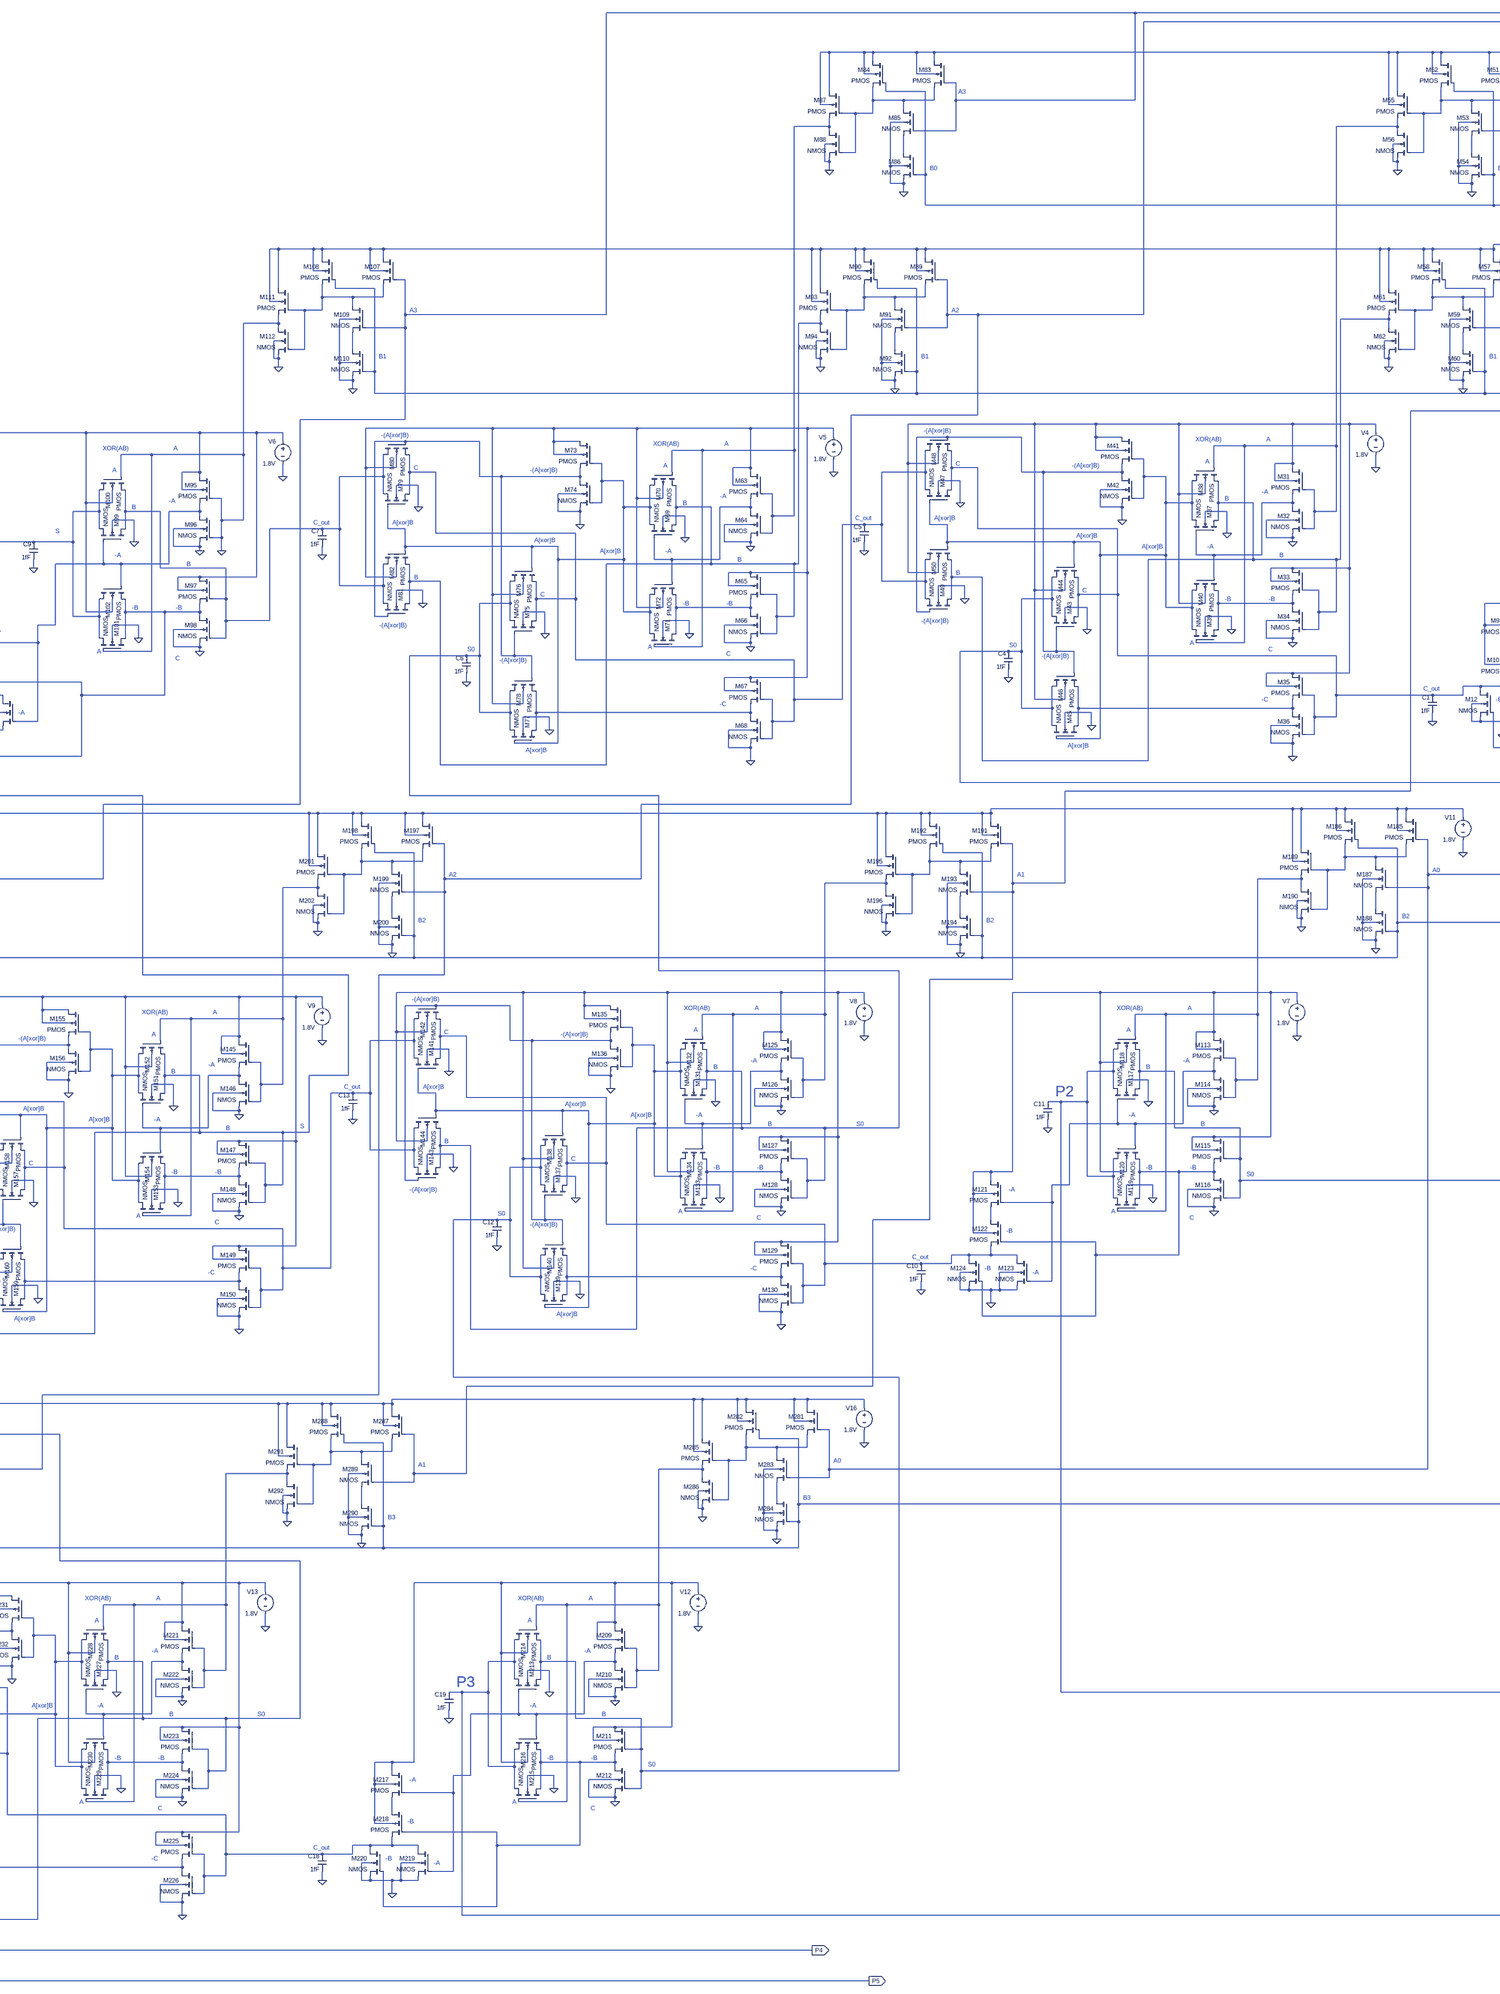
[diagram p18: sub-circuit multiplier.asc, part, row 1 of 1, column 2 of 3]
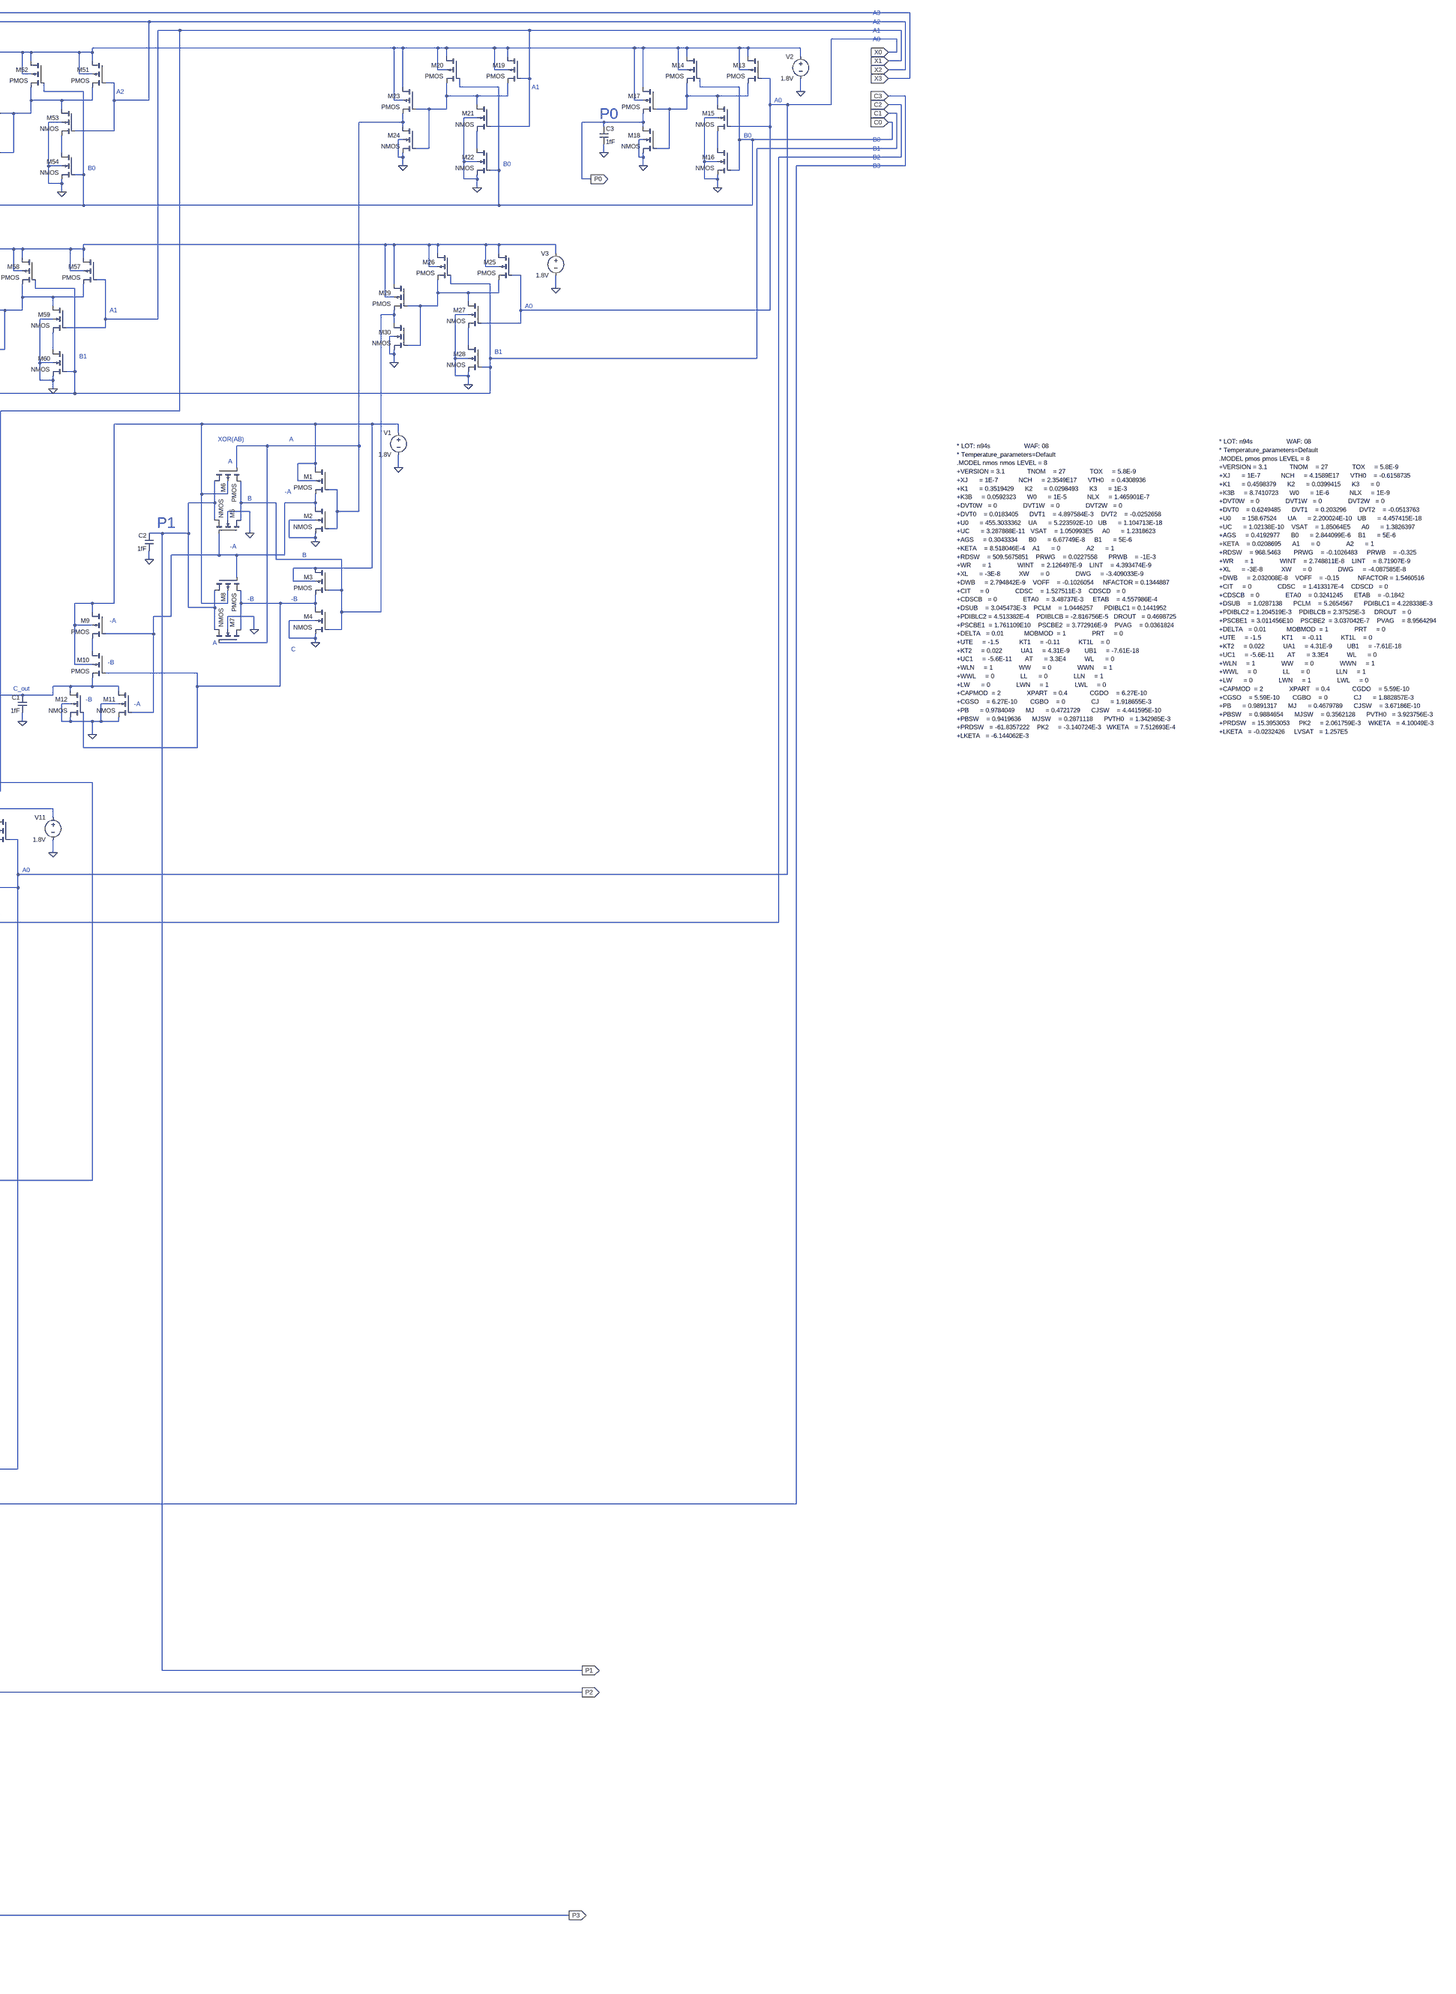
[diagram p19: sub-circuit multiplier.asc, part, row 1 of 1, column 3 of 3]
* Ex5_Ex_Multiplier_Working_Simplified.asc
V4 N006 0 1.8V
M61 N006 N004 N015 N006 PMOS l=180n w=8800n
M62 N015 N004 0 0 NMOS l=180n w=4400n
M63 N006 N008 N004 N006 PMOS l=180n w=6000n
M64 N006 N009 N004 N006 PMOS l=180n w=6000n
M65 N004 N009 N029 0 NMOS l=180n w=6000n
M66 N029 N008 0 0 NMOS l=180n w=6000n
V15 N043 0 1.8V
M99 N043 N041 N047 N043 PMOS l=180n w=8800n
M100 N047 N041 0 0 NMOS l=180n w=4400n
M101 N043 N044 N041 N043 PMOS l=180n w=6000n
M102 N043 N009 N041 N043 PMOS l=180n w=6000n
M103 N041 N009 N052 0 NMOS l=180n w=6000n
M104 N052 N044 0 0 NMOS l=180n w=6000n
V17 N049 0 0V
V18 N039 0 PULSE(0 1.8 3n 10p 10p 2.5n 4n 1)
V23 N082 0 1.8V
M137 N082 N079 N086 N082 PMOS l=180n w=8800n
M138 N086 N079 0 0 NMOS l=180n w=4400n
M139 N082 N046 N079 N082 PMOS l=180n w=6000n
M140 N082 N009 N079 N082 PMOS l=180n w=6000n
M141 N079 N009 N087 0 NMOS l=180n w=6000n
M142 N087 N046 0 0 NMOS l=180n w=6000n
V24 N051 0 0V
V2 N050 0 PULSE(0 1.8 2n 10p 10p 1,5n 2n)
V10 N048 0 PULSE(0 1.8 1n 10p 10p 1.5n 2n)
V16 N003 0 PULSE(0 1.8 0n 10p 10p 1.5n 2n)
V25 N042 0 PULSE(0 1.8 0 10p 10p 1n 2n 2)
V26 N045 0 PULSE(0 1.8 1n 10p 10p 2n 2.5n 1)
V9 N035 0 PULSE(0 1.8 4n 10p 10p 1.5n 2n 1)
XX1 N042 N045 N008 N044 N046 address_decoder
XX2 N039 N035 N001 N009 N040 N002 command_decoder
XX3 N004 N015 0 N003 0 0 N012 N014 N017 N020 4-bit_memory
XX4 N041 N047 N048 N049 N049 N049 N024 N028 N033 N037 4-bit_memory
XX5 N079 N086 N051 N051 N050 N051 N055 N058 N061 N064 4-bit_memory
XX6 N012 N014 N017 N020 N001 N024 N028 N033 N037 N002 N011 N013 N016 N019 N023 N027 N032 N036 N005 N010 logic_circuit_add-sub
XX7 N011 N013 N016 N019 N023 N027 N032 N036 N010 N018 N021 N026 N031 adder_subtractor
V1 N007 0 1.8V
M1 N007 N005 N022 N007 PMOS l=180n w=8800n
M2 N022 N005 0 0 NMOS l=180n w=4400n
XX8 N005 N022 N018 N021 N026 N031 N025 N030 N034 N038 4-bit_memory
XX9 N055 N058 N061 N064 N040 N025 N030 N034 N038 N054 N057 N060 N063 N067 N071 N074 N077 logic_circuit_multiply
XX10 N054 N057 N060 N063 N067 N071 N074 N077 N053 N056 N059 N062 N066 N070 N073 N076 multiplier
XX11 N065 N069 N053 N056 N059 N062 N066 N070 N073 N076 N068 N072 N075 N078 N080 N081 N083 N084 8-bit_memory
V5 N085 0 1.8V
M7 N085 N065 N069 N085 PMOS l=180n w=8800n
M8 N069 N065 0 0 NMOS l=180n w=4400n
M9 N085 N040 N065 N085 PMOS l=180n w=8800n
M10 N065 N040 0 0 NMOS l=180n w=4400n

* block symbol definitions
.subckt address_decoder I0 I1 Address_A Address_B Address_C
V1 N001 0 1.8V
M1 N001 N002 N003 N001 PMOS l=180n w=3520n
M2 N003 I1 Address_A N001 PMOS l=180n w=3520n
M3 Address_A N002 0 0 NMOS l=180n w=1760n
M4 Address_A I1 0 0 NMOS l=180n w=1760n
M5 N001 I0 N002 N001 PMOS l=180n w=880n
M6 N002 I0 0 0 NMOS l=180n w=440n
M7 N001 I1 N004 N001 PMOS l=180n w=880n
M8 N004 I1 0 0 NMOS l=180n w=440n
M9 N001 I0 N005 N001 PMOS l=180n w=3520n
M10 N005 N004 Address_B N001 PMOS l=180n w=3520n
M11 Address_B I0 0 0 NMOS l=180n w=1760n
M12 Address_B N004 0 0 NMOS l=180n w=1760n
M13 N001 N002 N006 N001 PMOS l=180n w=3520n
M14 N006 N004 Address_C N001 PMOS l=180n w=3520n
M15 Address_C N002 0 0 NMOS l=180n w=1760n
M16 Address_C N004 0 0 NMOS l=180n w=1760n
* I1
* I1
* -I0
* -I0
* I0
* I1
* -I0
* -I1
* I0
* I0
* -I1
* -I1
* -I1
* -I1
* -I0
* -I0
* LOT: n94s                  WAF: 08
* Temperature_parameters=Default
.MODEL nmos nmos LEVEL = 8
+VERSION = 3.1            TNOM    = 27             TOX     = 5.8E-9
+XJ      = 1E-7           NCH     = 2.3549E17      VTH0    = 0.4308936
+K1      = 0.3519429      K2      = 0.0298493      K3      = 1E-3
+K3B     = 0.0592323      W0      = 1E-5           NLX     = 1.465901E-7
+DVT0W   = 0              DVT1W   = 0              DVT2W   = 0
+DVT0    = 0.0183405      DVT1    = 4.897584E-3    DVT2    = -0.0252658
+U0      = 455.3033362    UA      = 5.223592E-10   UB      = 1.104713E-18
+UC      = 3.287888E-11   VSAT    = 1.050993E5     A0      = 1.2318623
+AGS     = 0.3043334      B0      = 6.67749E-8     B1      = 5E-6
+KETA    = 8.518046E-4    A1      = 0              A2      = 1
+RDSW    = 509.5675851    PRWG    = 0.0227558      PRWB    = -1E-3
+WR      = 1              WINT    = 2.126497E-9    LINT    = 4.393474E-9
+XL      = -3E-8          XW      = 0              DWG     = -3.409033E-9
+DWB     = 2.794842E-9    VOFF    = -0.1026054     NFACTOR = 0.1344887
+CIT     = 0              CDSC    = 1.527511E-3    CDSCD   = 0
+CDSCB   = 0              ETA0    = 3.48737E-3     ETAB    = 4.557986E-4
+DSUB    = 3.045473E-3    PCLM    = 1.0446257      PDIBLC1 = 0.1441952
+PDIBLC2 = 4.513382E-4    PDIBLCB = -2.816756E-5   DROUT   = 0.4698725
+PSCBE1  = 1.761109E10    PSCBE2  = 3.772916E-9    PVAG    = 0.0361824
+DELTA   = 0.01           MOBMOD  = 1              PRT     = 0
+UTE     = -1.5           KT1     = -0.11          KT1L    = 0
+KT2     = 0.022          UA1     = 4.31E-9        UB1     = -7.61E-18
+UC1     = -5.6E-11       AT      = 3.3E4          WL      = 0
+WLN     = 1              WW      = 0              WWN     = 1
+WWL     = 0              LL      = 0              LLN     = 1
+LW      = 0              LWN     = 1              LWL     = 0
+CAPMOD  = 2              XPART   = 0.4            CGDO    = 6.27E-10
+CGSO    = 6.27E-10       CGBO    = 0              CJ      = 1.918655E-3
+PB      = 0.9784049      MJ      = 0.4721729      CJSW    = 4.441595E-10
+PBSW    = 0.9419636      MJSW    = 0.2871118      PVTH0   = 1.342985E-3
+PRDSW   = -61.8357222    PK2     = -3.140724E-3   WKETA   = 7.512693E-4
+LKETA   = -6.144062E-3
* LOT: n94s                  WAF: 08
* Temperature_parameters=Default
.MODEL pmos pmos LEVEL = 8
+VERSION = 3.1            TNOM    = 27             TOX     = 5.8E-9
+XJ      = 1E-7           NCH     = 4.1589E17      VTH0    = -0.6158735
+K1      = 0.4598379      K2      = 0.0399415      K3      = 0
+K3B     = 8.7410723      W0      = 1E-6           NLX     = 1E-9
+DVT0W   = 0              DVT1W   = 0              DVT2W   = 0
+DVT0    = 0.6249485      DVT1    = 0.203296       DVT2    = -0.0513763
+U0      = 158.67524      UA      = 2.200024E-10   UB      = 4.457415E-18
+UC      = 1.02138E-10    VSAT    = 1.85064E5      A0      = 1.3826397
+AGS     = 0.4192977      B0      = 2.844099E-6    B1      = 5E-6
+KETA    = 0.0208695      A1      = 0              A2      = 1
+RDSW    = 968.5463       PRWG    = -0.1026483     PRWB    = -0.325
+WR      = 1              WINT    = 2.748811E-8    LINT    = 8.71907E-9
+XL      = -3E-8          XW      = 0              DWG     = -4.087585E-8
+DWB     = 2.032008E-8    VOFF    = -0.15          NFACTOR = 1.5460516
+CIT     = 0              CDSC    = 1.413317E-4    CDSCD   = 0
+CDSCB   = 0              ETA0    = 0.3241245      ETAB    = -0.1842
+DSUB    = 1.0287138      PCLM    = 5.2654567      PDIBLC1 = 4.228338E-3
+PDIBLC2 = 1.204519E-3    PDIBLCB = 2.37525E-3     DROUT   = 0
+PSCBE1  = 3.011456E10    PSCBE2  = 3.037042E-7    PVAG    = 8.9564294
+DELTA   = 0.01           MOBMOD  = 1              PRT     = 0
+UTE     = -1.5           KT1     = -0.11          KT1L    = 0
+KT2     = 0.022          UA1     = 4.31E-9        UB1     = -7.61E-18
+UC1     = -5.6E-11       AT      = 3.3E4          WL      = 0
+WLN     = 1              WW      = 0              WWN     = 1
+WWL     = 0              LL      = 0              LLN     = 1
+LW      = 0              LWN     = 1              LWL     = 0
+CAPMOD  = 2              XPART   = 0.4            CGDO    = 5.59E-10
+CGSO    = 5.59E-10       CGBO    = 0              CJ      = 1.882857E-3
+PB      = 0.9891317      MJ      = 0.4679789      CJSW    = 3.67186E-10
+PBSW    = 0.9884654      MJSW    = 0.3562128      PVTH0   = 3.923756E-3
+PRDSW   = 15.3953053     PK2     = 2.061759E-3    WKETA   = 4.10049E-3
+LKETA   = -0.0232426     LVSAT   = 1.257E5
.ends address_decoder

.subckt command_decoder I0 I1 Adder Load Multiply Subtract
V1 N001 0 1.8V
M1 N001 I0 N003 N001 PMOS l=180n w=4400n
M2 N003 I1 Load N001 PMOS l=180n w=4400n
M3 Load I0 0 0 NMOS l=180n w=2200n
M4 Load I1 0 0 NMOS l=180n w=2200n
M5 N001 I0 N002 N001 PMOS l=180n w=3000n
M6 N002 I0 0 0 NMOS l=180n w=1500n
M7 N001 N002 N005 N001 PMOS l=180n w=4400n
M8 N005 I1 Adder N001 PMOS l=180n w=4400n
M9 Adder I1 0 0 NMOS l=180n w=2200n
M10 Adder N002 0 0 NMOS l=180n w=2200n
M11 N001 I1 N004 N001 PMOS l=180n w=3000n
M12 N004 I1 0 0 NMOS l=180n w=1500n
M13 N001 I0 N006 N001 PMOS l=180n w=4400n
M14 Subtract I0 0 0 NMOS l=180n w=2200n
M15 N006 N004 Subtract N001 PMOS l=180n w=4400n
M16 Subtract N004 0 0 NMOS l=180n w=2200n
M17 Multiply N004 0 0 NMOS l=180n w=2200n
M18 N001 N002 N007 N001 PMOS l=180n w=4400n
M19 N007 N004 Multiply N001 PMOS l=180n w=4400n
M20 Multiply N002 0 0 NMOS l=180n w=2200n
* I0
* I1
* I0
* I1
* Load
* I1
* I1
* -I0
* -I0
* I0
* I1
* -I0
* -I1
* Adder
* I0
* I0
* -I1
* -I1
* -I1
* -I1
* Subtract
* -I0
* -I0
* Multiply
* LOT: n94s                  WAF: 08
* Temperature_parameters=Default
.MODEL nmos nmos LEVEL = 8
+VERSION = 3.1            TNOM    = 27             TOX     = 5.8E-9
+XJ      = 1E-7           NCH     = 2.3549E17      VTH0    = 0.4308936
+K1      = 0.3519429      K2      = 0.0298493      K3      = 1E-3
+K3B     = 0.0592323      W0      = 1E-5           NLX     = 1.465901E-7
+DVT0W   = 0              DVT1W   = 0              DVT2W   = 0
+DVT0    = 0.0183405      DVT1    = 4.897584E-3    DVT2    = -0.0252658
+U0      = 455.3033362    UA      = 5.223592E-10   UB      = 1.104713E-18
+UC      = 3.287888E-11   VSAT    = 1.050993E5     A0      = 1.2318623
+AGS     = 0.3043334      B0      = 6.67749E-8     B1      = 5E-6
+KETA    = 8.518046E-4    A1      = 0              A2      = 1
+RDSW    = 509.5675851    PRWG    = 0.0227558      PRWB    = -1E-3
+WR      = 1              WINT    = 2.126497E-9    LINT    = 4.393474E-9
+XL      = -3E-8          XW      = 0              DWG     = -3.409033E-9
+DWB     = 2.794842E-9    VOFF    = -0.1026054     NFACTOR = 0.1344887
+CIT     = 0              CDSC    = 1.527511E-3    CDSCD   = 0
+CDSCB   = 0              ETA0    = 3.48737E-3     ETAB    = 4.557986E-4
+DSUB    = 3.045473E-3    PCLM    = 1.0446257      PDIBLC1 = 0.1441952
+PDIBLC2 = 4.513382E-4    PDIBLCB = -2.816756E-5   DROUT   = 0.4698725
+PSCBE1  = 1.761109E10    PSCBE2  = 3.772916E-9    PVAG    = 0.0361824
+DELTA   = 0.01           MOBMOD  = 1              PRT     = 0
+UTE     = -1.5           KT1     = -0.11          KT1L    = 0
+KT2     = 0.022          UA1     = 4.31E-9        UB1     = -7.61E-18
+UC1     = -5.6E-11       AT      = 3.3E4          WL      = 0
+WLN     = 1              WW      = 0              WWN     = 1
+WWL     = 0              LL      = 0              LLN     = 1
+LW      = 0              LWN     = 1              LWL     = 0
+CAPMOD  = 2              XPART   = 0.4            CGDO    = 6.27E-10
+CGSO    = 6.27E-10       CGBO    = 0              CJ      = 1.918655E-3
+PB      = 0.9784049      MJ      = 0.4721729      CJSW    = 4.441595E-10
+PBSW    = 0.9419636      MJSW    = 0.2871118      PVTH0   = 1.342985E-3
+PRDSW   = -61.8357222    PK2     = -3.140724E-3   WKETA   = 7.512693E-4
+LKETA   = -6.144062E-3
* LOT: n94s                  WAF: 08
* Temperature_parameters=Default
.MODEL pmos pmos LEVEL = 8
+VERSION = 3.1            TNOM    = 27             TOX     = 5.8E-9
+XJ      = 1E-7           NCH     = 4.1589E17      VTH0    = -0.6158735
+K1      = 0.4598379      K2      = 0.0399415      K3      = 0
+K3B     = 8.7410723      W0      = 1E-6           NLX     = 1E-9
+DVT0W   = 0              DVT1W   = 0              DVT2W   = 0
+DVT0    = 0.6249485      DVT1    = 0.203296       DVT2    = -0.0513763
+U0      = 158.67524      UA      = 2.200024E-10   UB      = 4.457415E-18
+UC      = 1.02138E-10    VSAT    = 1.85064E5      A0      = 1.3826397
+AGS     = 0.4192977      B0      = 2.844099E-6    B1      = 5E-6
+KETA    = 0.0208695      A1      = 0              A2      = 1
+RDSW    = 968.5463       PRWG    = -0.1026483     PRWB    = -0.325
+WR      = 1              WINT    = 2.748811E-8    LINT    = 8.71907E-9
+XL      = -3E-8          XW      = 0              DWG     = -4.087585E-8
+DWB     = 2.032008E-8    VOFF    = -0.15          NFACTOR = 1.5460516
+CIT     = 0              CDSC    = 1.413317E-4    CDSCD   = 0
+CDSCB   = 0              ETA0    = 0.3241245      ETAB    = -0.1842
+DSUB    = 1.0287138      PCLM    = 5.2654567      PDIBLC1 = 4.228338E-3
+PDIBLC2 = 1.204519E-3    PDIBLCB = 2.37525E-3     DROUT   = 0
+PSCBE1  = 3.011456E10    PSCBE2  = 3.037042E-7    PVAG    = 8.9564294
+DELTA   = 0.01           MOBMOD  = 1              PRT     = 0
+UTE     = -1.5           KT1     = -0.11          KT1L    = 0
+KT2     = 0.022          UA1     = 4.31E-9        UB1     = -7.61E-18
+UC1     = -5.6E-11       AT      = 3.3E4          WL      = 0
+WLN     = 1              WW      = 0              WWN     = 1
+WWL     = 0              LL      = 0              LLN     = 1
+LW      = 0              LWN     = 1              LWL     = 0
+CAPMOD  = 2              XPART   = 0.4            CGDO    = 5.59E-10
+CGSO    = 5.59E-10       CGBO    = 0              CJ      = 1.882857E-3
+PB      = 0.9891317      MJ      = 0.4679789      CJSW    = 3.67186E-10
+PBSW    = 0.9884654      MJSW    = 0.3562128      PVTH0   = 3.923756E-3
+PRDSW   = 15.3953053     PK2     = 2.061759E-3    WKETA   = 4.10049E-3
+LKETA   = -0.0232426     LVSAT   = 1.257E5
.ends command_decoder

.subckt 4-bit_memory Clk Clk_bar w0 w1 w2 w3 M0 M1 M2 M3
M1 N004 Clk N007 N002 PMOS l=180n w=6000n
M2 N007 Clk_bar N004 0 NMOS l=180n w=6000n
M3 N002 N004 M0 N002 PMOS l=180n w=3520n
M4 M0 N004 0 0 NMOS l=180n w=1760n
M5 N004 M0 N002 N002 PMOS l=180n w=880n
M6 0 M0 N004 0 NMOS l=180n w=440n
V1 N002 0 1.8V
C1 N004 0 1fF
C2 M0 0 1fF
M7 N011 Clk N012 N009 PMOS l=180n w=6000n
M8 N012 Clk_bar N011 0 NMOS l=180n w=6000n
M9 N009 N011 M2 N009 PMOS l=180n w=3520n
M10 M2 N011 0 0 NMOS l=180n w=1760n
M11 N011 M2 N009 N009 PMOS l=180n w=880n
M12 0 M2 N011 0 NMOS l=180n w=440n
V2 N009 0 1.8V
C3 N011 0 1fF
C4 M2 0 1fF
M13 N003 Clk N005 N001 PMOS l=180n w=6000n
M14 N005 Clk_bar N003 0 NMOS l=180n w=6000n
M15 N001 N003 M1 N001 PMOS l=180n w=3520n
M16 M1 N003 0 0 NMOS l=180n w=1760n
M17 N003 M1 N001 N001 PMOS l=180n w=880n
M18 0 M1 N003 0 NMOS l=180n w=440n
V3 N001 0 1.8V
C5 N003 0 1fF
C6 M1 0 1fF
M19 N010 Clk N013 N008 PMOS l=180n w=6000n
M20 N013 Clk_bar N010 0 NMOS l=180n w=6000n
M21 N008 N010 M3 N008 PMOS l=180n w=3520n
M22 M3 N010 0 0 NMOS l=180n w=1760n
M23 N010 M3 N008 N008 PMOS l=180n w=880n
M24 0 M3 N010 0 NMOS l=180n w=440n
V4 N008 0 1.8V
C7 N010 0 1fF
C8 M3 0 1fF
V5 N006 0 1.8V
M28 N006 w2 N012 N006 PMOS l=180n w=4000n
M29 N012 w2 0 0 NMOS l=180n w=2000n
M30 N006 w3 N013 N006 PMOS l=180n w=4000n
M31 N013 w3 0 0 NMOS l=180n w=2000n
M32 N006 w1 N005 N006 PMOS l=180n w=4000n
M33 N006 w0 N007 N006 PMOS l=180n w=4000n
M34 N005 w1 0 0 NMOS l=180n w=2000n
M35 N007 w0 0 0 NMOS l=180n w=2000n
* CLK
* CLK_bar
* D_bar
* D
* D
* Q
* D
* CLK
* CLK_bar
* D_bar
* D
* D
* Q
* D
* CLK
* CLK_bar
* D_bar
* D
* D
* Q
* D
* CLK
* CLK_bar
* D_bar
* D
* D
* Q
* D
* CLK
* CLK_bar
* A0
* w0
* w1
* w2
* w3
* A1
* A2
* A3
* -w0
* -w1
* -w2
* -w3
* LOT: n94s                  WAF: 08
* Temperature_parameters=Default
.MODEL nmos nmos LEVEL = 8
+VERSION = 3.1            TNOM    = 27             TOX     = 5.8E-9
+XJ      = 1E-7           NCH     = 2.3549E17      VTH0    = 0.4308936
+K1      = 0.3519429      K2      = 0.0298493      K3      = 1E-3
+K3B     = 0.0592323      W0      = 1E-5           NLX     = 1.465901E-7
+DVT0W   = 0              DVT1W   = 0              DVT2W   = 0
+DVT0    = 0.0183405      DVT1    = 4.897584E-3    DVT2    = -0.0252658
+U0      = 455.3033362    UA      = 5.223592E-10   UB      = 1.104713E-18
+UC      = 3.287888E-11   VSAT    = 1.050993E5     A0      = 1.2318623
+AGS     = 0.3043334      B0      = 6.67749E-8     B1      = 5E-6
+KETA    = 8.518046E-4    A1      = 0              A2      = 1
+RDSW    = 509.5675851    PRWG    = 0.0227558      PRWB    = -1E-3
+WR      = 1              WINT    = 2.126497E-9    LINT    = 4.393474E-9
+XL      = -3E-8          XW      = 0              DWG     = -3.409033E-9
+DWB     = 2.794842E-9    VOFF    = -0.1026054     NFACTOR = 0.1344887
+CIT     = 0              CDSC    = 1.527511E-3    CDSCD   = 0
+CDSCB   = 0              ETA0    = 3.48737E-3     ETAB    = 4.557986E-4
+DSUB    = 3.045473E-3    PCLM    = 1.0446257      PDIBLC1 = 0.1441952
+PDIBLC2 = 4.513382E-4    PDIBLCB = -2.816756E-5   DROUT   = 0.4698725
+PSCBE1  = 1.761109E10    PSCBE2  = 3.772916E-9    PVAG    = 0.0361824
+DELTA   = 0.01           MOBMOD  = 1              PRT     = 0
+UTE     = -1.5           KT1     = -0.11          KT1L    = 0
+KT2     = 0.022          UA1     = 4.31E-9        UB1     = -7.61E-18
+UC1     = -5.6E-11       AT      = 3.3E4          WL      = 0
+WLN     = 1              WW      = 0              WWN     = 1
+WWL     = 0              LL      = 0              LLN     = 1
+LW      = 0              LWN     = 1              LWL     = 0
+CAPMOD  = 2              XPART   = 0.4            CGDO    = 6.27E-10
+CGSO    = 6.27E-10       CGBO    = 0              CJ      = 1.918655E-3
+PB      = 0.9784049      MJ      = 0.4721729      CJSW    = 4.441595E-10
+PBSW    = 0.9419636      MJSW    = 0.2871118      PVTH0   = 1.342985E-3
+PRDSW   = -61.8357222    PK2     = -3.140724E-3   WKETA   = 7.512693E-4
+LKETA   = -6.144062E-3
* LOT: n94s                  WAF: 08
* Temperature_parameters=Default
.MODEL pmos pmos LEVEL = 8
+VERSION = 3.1            TNOM    = 27             TOX     = 5.8E-9
+XJ      = 1E-7           NCH     = 4.1589E17      VTH0    = -0.6158735
+K1      = 0.4598379      K2      = 0.0399415      K3      = 0
+K3B     = 8.7410723      W0      = 1E-6           NLX     = 1E-9
+DVT0W   = 0              DVT1W   = 0              DVT2W   = 0
+DVT0    = 0.6249485      DVT1    = 0.203296       DVT2    = -0.0513763
+U0      = 158.67524      UA      = 2.200024E-10   UB      = 4.457415E-18
+UC      = 1.02138E-10    VSAT    = 1.85064E5      A0      = 1.3826397
+AGS     = 0.4192977      B0      = 2.844099E-6    B1      = 5E-6
+KETA    = 0.0208695      A1      = 0              A2      = 1
+RDSW    = 968.5463       PRWG    = -0.1026483     PRWB    = -0.325
+WR      = 1              WINT    = 2.748811E-8    LINT    = 8.71907E-9
+XL      = -3E-8          XW      = 0              DWG     = -4.087585E-8
+DWB     = 2.032008E-8    VOFF    = -0.15          NFACTOR = 1.5460516
+CIT     = 0              CDSC    = 1.413317E-4    CDSCD   = 0
+CDSCB   = 0              ETA0    = 0.3241245      ETAB    = -0.1842
+DSUB    = 1.0287138      PCLM    = 5.2654567      PDIBLC1 = 4.228338E-3
+PDIBLC2 = 1.204519E-3    PDIBLCB = 2.37525E-3     DROUT   = 0
+PSCBE1  = 3.011456E10    PSCBE2  = 3.037042E-7    PVAG    = 8.9564294
+DELTA   = 0.01           MOBMOD  = 1              PRT     = 0
+UTE     = -1.5           KT1     = -0.11          KT1L    = 0
+KT2     = 0.022          UA1     = 4.31E-9        UB1     = -7.61E-18
+UC1     = -5.6E-11       AT      = 3.3E4          WL      = 0
+WLN     = 1              WW      = 0              WWN     = 1
+WWL     = 0              LL      = 0              LLN     = 1
+LW      = 0              LWN     = 1              LWL     = 0
+CAPMOD  = 2              XPART   = 0.4            CGDO    = 5.59E-10
+CGSO    = 5.59E-10       CGBO    = 0              CJ      = 1.882857E-3
+PB      = 0.9891317      MJ      = 0.4679789      CJSW    = 3.67186E-10
+PBSW    = 0.9884654      MJSW    = 0.3562128      PVTH0   = 3.923756E-3
+PRDSW   = 15.3953053     PK2     = 2.061759E-3    WKETA   = 4.10049E-3
+LKETA   = -0.0232426     LVSAT   = 1.257E5
.ends 4-bit_memory

.subckt logic_circuit_add-sub A0_I A1_I A2_I A3_I Add B0_I B1_I B2_I B3_I Subtract A0 A1 A2 A3 B0 B1 B2 B3 Clk Ctrl
V1 N004 0 1.8V
M1 N001 Add N002 N001 PMOS l=180n w=6000n
V2 N001 0 1.8V
M2 N001 Subtract N003 N001 PMOS l=180n w=3000n
M3 N003 Subtract 0 0 NMOS l=180n w=1500n
V3 N006 0 1.8V
M4 N006 A0_I N009 N006 PMOS l=180n w=880n
M5 N009 A0_I 0 0 NMOS l=180n w=440n
V4 N011 0 1.8V
M6 N011 A1_I N015 N011 PMOS l=180n w=880n
M7 N015 A1_I 0 0 NMOS l=180n w=440n
M8 N006 A2_I N010 N006 PMOS l=180n w=880n
M9 N010 A2_I 0 0 NMOS l=180n w=440n
M10 N011 A3_I N014 N011 PMOS l=180n w=880n
M11 N014 A3_I 0 0 NMOS l=180n w=440n
M22 N002 N003 Ctrl N001 PMOS l=180n w=6000n
M23 Ctrl N003 0 0 NMOS l=180n w=1500n
M24 Ctrl Add 0 0 NMOS l=180n w=1500n
M25 N004 Add N005 N004 PMOS l=180n w=6000n
M26 N005 Subtract Clk N004 PMOS l=180n w=6000n
M27 Clk Add 0 0 NMOS l=180n w=2500n
M28 Clk Subtract 0 0 NMOS l=180n w=2500n
M31 A1 Clk 0 0 NMOS l=180n w=750n
M32 N011 Clk N013 N011 PMOS l=180n w=3000n
M33 A1 N015 0 0 NMOS l=180n w=750n
M34 N013 N015 A1 N011 PMOS l=180n w=3000n
M35 N006 Clk N007 N006 PMOS l=180n w=3000n
M36 N007 N009 A0 N006 PMOS l=180n w=3000n
M37 A0 Clk 0 0 NMOS l=180n w=750n
M38 A0 N009 0 0 NMOS l=180n w=750n
M39 N006 Clk N008 N006 PMOS l=180n w=3000n
M40 A2 Clk 0 0 NMOS l=180n w=750n
M41 A2 N010 0 0 NMOS l=180n w=750n
M42 N008 N010 A2 N006 PMOS l=180n w=3000n
M43 N011 Clk N012 N011 PMOS l=180n w=3000n
M44 N012 N014 A3 N011 PMOS l=180n w=3000n
M45 A3 Clk 0 0 NMOS l=180n w=750n
M46 A3 N014 0 0 NMOS l=180n w=750n
M12 B0 Clk 0 0 NMOS l=180n w=750n
M13 N016 Clk N017 N016 PMOS l=180n w=3000n
V5 N016 0 1.8V
M14 N016 B0_I N019 N016 PMOS l=180n w=880n
M15 N019 B0_I 0 0 NMOS l=180n w=440n
V6 N021 0 1.8V
M16 N021 B1_I N025 N021 PMOS l=180n w=880n
M17 N025 B1_I 0 0 NMOS l=180n w=440n
M18 N016 B2_I N020 N016 PMOS l=180n w=880n
M19 N020 B2_I 0 0 NMOS l=180n w=440n
M20 N021 B3_I N024 N021 PMOS l=180n w=880n
M21 N024 B3_I 0 0 NMOS l=180n w=440n
M29 N017 N019 B0 N016 PMOS l=180n w=3000n
M30 B0 N019 0 0 NMOS l=180n w=750n
M47 B1 Clk 0 0 NMOS l=180n w=750n
M48 B3 N024 0 0 NMOS l=180n w=750n
M49 B2 N020 0 0 NMOS l=180n w=750n
M50 N016 Clk N018 N016 PMOS l=180n w=3000n
M51 N018 N020 B2 N016 PMOS l=180n w=3000n
M52 N021 Clk N023 N021 PMOS l=180n w=3000n
M53 N023 N025 B1 N021 PMOS l=180n w=3000n
M54 N021 Clk N022 N021 PMOS l=180n w=3000n
M55 N022 N024 B3 N021 PMOS l=180n w=3000n
M56 B3 Clk 0 0 NMOS l=180n w=750n
M57 B1 N025 0 0 NMOS l=180n w=750n
M58 B2 Clk 0 0 NMOS l=180n w=750n
* Adder
* Subtract
* Adder
* -Subtract
* Ctrl
* NOR(Add+Sub)
* NOR(Add+Sub)
* -A0
* NOR(Add+Sub)
* A0
* -A1
* A1
* A1
* A0
* NOR(Add+Sub)
* A2
* -A2
* A2
* NOR(Add+Sub)
* A3
* -A3
* A3
* LOT: n94s                  WAF: 08
* Temperature_parameters=Default
.MODEL nmos nmos LEVEL = 8
+VERSION = 3.1            TNOM    = 27             TOX     = 5.8E-9
+XJ      = 1E-7           NCH     = 2.3549E17      VTH0    = 0.4308936
+K1      = 0.3519429      K2      = 0.0298493      K3      = 1E-3
+K3B     = 0.0592323      W0      = 1E-5           NLX     = 1.465901E-7
+DVT0W   = 0              DVT1W   = 0              DVT2W   = 0
+DVT0    = 0.0183405      DVT1    = 4.897584E-3    DVT2    = -0.0252658
+U0      = 455.3033362    UA      = 5.223592E-10   UB      = 1.104713E-18
+UC      = 3.287888E-11   VSAT    = 1.050993E5     A0      = 1.2318623
+AGS     = 0.3043334      B0      = 6.67749E-8     B1      = 5E-6
+KETA    = 8.518046E-4    A1      = 0              A2      = 1
+RDSW    = 509.5675851    PRWG    = 0.0227558      PRWB    = -1E-3
+WR      = 1              WINT    = 2.126497E-9    LINT    = 4.393474E-9
+XL      = -3E-8          XW      = 0              DWG     = -3.409033E-9
+DWB     = 2.794842E-9    VOFF    = -0.1026054     NFACTOR = 0.1344887
+CIT     = 0              CDSC    = 1.527511E-3    CDSCD   = 0
+CDSCB   = 0              ETA0    = 3.48737E-3     ETAB    = 4.557986E-4
+DSUB    = 3.045473E-3    PCLM    = 1.0446257      PDIBLC1 = 0.1441952
+PDIBLC2 = 4.513382E-4    PDIBLCB = -2.816756E-5   DROUT   = 0.4698725
+PSCBE1  = 1.761109E10    PSCBE2  = 3.772916E-9    PVAG    = 0.0361824
+DELTA   = 0.01           MOBMOD  = 1              PRT     = 0
+UTE     = -1.5           KT1     = -0.11          KT1L    = 0
+KT2     = 0.022          UA1     = 4.31E-9        UB1     = -7.61E-18
+UC1     = -5.6E-11       AT      = 3.3E4          WL      = 0
+WLN     = 1              WW      = 0              WWN     = 1
+WWL     = 0              LL      = 0              LLN     = 1
+LW      = 0              LWN     = 1              LWL     = 0
+CAPMOD  = 2              XPART   = 0.4            CGDO    = 6.27E-10
+CGSO    = 6.27E-10       CGBO    = 0              CJ      = 1.918655E-3
+PB      = 0.9784049      MJ      = 0.4721729      CJSW    = 4.441595E-10
+PBSW    = 0.9419636      MJSW    = 0.2871118      PVTH0   = 1.342985E-3
+PRDSW   = -61.8357222    PK2     = -3.140724E-3   WKETA   = 7.512693E-4
+LKETA   = -6.144062E-3
* LOT: n94s                  WAF: 08
* Temperature_parameters=Default
.MODEL pmos pmos LEVEL = 8
+VERSION = 3.1            TNOM    = 27             TOX     = 5.8E-9
+XJ      = 1E-7           NCH     = 4.1589E17      VTH0    = -0.6158735
+K1      = 0.4598379      K2      = 0.0399415      K3      = 0
+K3B     = 8.7410723      W0      = 1E-6           NLX     = 1E-9
+DVT0W   = 0              DVT1W   = 0              DVT2W   = 0
+DVT0    = 0.6249485      DVT1    = 0.203296       DVT2    = -0.0513763
+U0      = 158.67524      UA      = 2.200024E-10   UB      = 4.457415E-18
+UC      = 1.02138E-10    VSAT    = 1.85064E5      A0      = 1.3826397
+AGS     = 0.4192977      B0      = 2.844099E-6    B1      = 5E-6
+KETA    = 0.0208695      A1      = 0              A2      = 1
+RDSW    = 968.5463       PRWG    = -0.1026483     PRWB    = -0.325
+WR      = 1              WINT    = 2.748811E-8    LINT    = 8.71907E-9
+XL      = -3E-8          XW      = 0              DWG     = -4.087585E-8
+DWB     = 2.032008E-8    VOFF    = -0.15          NFACTOR = 1.5460516
+CIT     = 0              CDSC    = 1.413317E-4    CDSCD   = 0
+CDSCB   = 0              ETA0    = 0.3241245      ETAB    = -0.1842
+DSUB    = 1.0287138      PCLM    = 5.2654567      PDIBLC1 = 4.228338E-3
+PDIBLC2 = 1.204519E-3    PDIBLCB = 2.37525E-3     DROUT   = 0
+PSCBE1  = 3.011456E10    PSCBE2  = 3.037042E-7    PVAG    = 8.9564294
+DELTA   = 0.01           MOBMOD  = 1              PRT     = 0
+UTE     = -1.5           KT1     = -0.11          KT1L    = 0
+KT2     = 0.022          UA1     = 4.31E-9        UB1     = -7.61E-18
+UC1     = -5.6E-11       AT      = 3.3E4          WL      = 0
+WLN     = 1              WW      = 0              WWN     = 1
+WWL     = 0              LL      = 0              LLN     = 1
+LW      = 0              LWN     = 1              LWL     = 0
+CAPMOD  = 2              XPART   = 0.4            CGDO    = 5.59E-10
+CGSO    = 5.59E-10       CGBO    = 0              CJ      = 1.882857E-3
+PB      = 0.9891317      MJ      = 0.4679789      CJSW    = 3.67186E-10
+PBSW    = 0.9884654      MJSW    = 0.3562128      PVTH0   = 3.923756E-3
+PRDSW   = 15.3953053     PK2     = 2.061759E-3    WKETA   = 4.10049E-3
+LKETA   = -0.0232426     LVSAT   = 1.257E5
* NOR(Add+Sub)
* NOR(Add+Sub)
* NOR(Add+Sub)
* NOR(Add+Sub)
* B0
* B1
* B3
* B2
* -B0
* -B1
* -B2
* -B3
* B0
* B1
* B2
* B3
.ends logic_circuit_add-sub

.subckt adder_subtractor A0 A1 A2 A3 B0 B1 B2 B3 Ctrl S0 S1 S2 S3
V1 N017 0 1.8V
M1 N017 A0 N033 N017 PMOS l=180n w=880n
M2 N033 A0 0 0 NMOS l=180n w=440n
M3 N017 N004 N037 N017 PMOS l=180n w=880n
M4 N037 N004 0 0 NMOS l=180n w=440n
M5 N017 Ctrl N041 N017 PMOS l=180n w=880n
M6 N041 Ctrl 0 0 NMOS l=180n w=440n
M7 N004 N033 N025 0 NMOS l=180n w=440n
M8 N025 A0 N004 N017 PMOS l=180n w=440n
M9 N037 A0 N025 0 NMOS l=180n w=440n
M10 N025 N033 N037 N017 PMOS l=180n w=440n
M11 N017 N025 N021 N017 PMOS l=180n w=880n
M12 N021 N025 0 0 NMOS l=180n w=440n
M13 Ctrl N021 S0 0 NMOS l=180n w=440n
M14 S0 N025 Ctrl N017 PMOS l=180n w=440n
M15 N041 N025 S0 0 NMOS l=180n w=440n
M16 S0 N021 N041 N017 PMOS l=180n w=440n
C1 S0 0 1fF
M17 Ctrl N025 N028 0 NMOS l=180n w=440n
M18 N028 N021 Ctrl N017 PMOS l=180n w=440n
M19 N004 N021 N028 0 NMOS l=180n w=440n
M20 N028 N025 N004 N017 PMOS l=180n w=440n
C2 N028 0 1fF
V2 N016 0 1.8V
M21 N016 A1 N032 N016 PMOS l=180n w=880n
M22 N032 A1 0 0 NMOS l=180n w=440n
M23 N016 N005 N036 N016 PMOS l=180n w=880n
M24 N036 N005 0 0 NMOS l=180n w=440n
M25 N016 N028 N040 N016 PMOS l=180n w=880n
M26 N040 N028 0 0 NMOS l=180n w=440n
M27 N005 N032 N024 0 NMOS l=180n w=440n
M28 N024 A1 N005 N016 PMOS l=180n w=440n
M29 N036 A1 N024 0 NMOS l=180n w=440n
M30 N024 N032 N036 N016 PMOS l=180n w=440n
M31 N016 N024 N020 N016 PMOS l=180n w=880n
M32 N020 N024 0 0 NMOS l=180n w=440n
M33 N028 N020 S1 0 NMOS l=180n w=440n
M34 S1 N024 N028 N016 PMOS l=180n w=440n
M35 N040 N024 S1 0 NMOS l=180n w=440n
M36 S1 N020 N040 N016 PMOS l=180n w=440n
C3 S1 0 1fF
M37 N028 N024 N027 0 NMOS l=180n w=440n
M38 N027 N020 N028 N016 PMOS l=180n w=440n
M39 N005 N020 N027 0 NMOS l=180n w=440n
M40 N027 N024 N005 N016 PMOS l=180n w=440n
C4 N027 0 1fF
V3 N015 0 1.8V
M41 N015 A2 N031 N015 PMOS l=180n w=880n
M42 N031 A2 0 0 NMOS l=180n w=440n
M43 N015 N003 N035 N015 PMOS l=180n w=880n
M44 N035 N003 0 0 NMOS l=180n w=440n
M45 N015 N027 N039 N015 PMOS l=180n w=880n
M46 N039 N027 0 0 NMOS l=180n w=440n
M47 N003 N031 N023 0 NMOS l=180n w=440n
M48 N023 A2 N003 N015 PMOS l=180n w=440n
M49 N035 A2 N023 0 NMOS l=180n w=440n
M50 N023 N031 N035 N015 PMOS l=180n w=440n
M51 N015 N023 N019 N015 PMOS l=180n w=880n
M52 N019 N023 0 0 NMOS l=180n w=440n
M53 N027 N019 S2 0 NMOS l=180n w=440n
M54 S2 N023 N027 N015 PMOS l=180n w=440n
M55 N039 N023 S2 0 NMOS l=180n w=440n
M56 S2 N019 N039 N015 PMOS l=180n w=440n
C5 S2 0 1fF
M57 N027 N023 N026 0 NMOS l=180n w=440n
M58 N026 N019 N027 N015 PMOS l=180n w=440n
M59 N003 N019 N026 0 NMOS l=180n w=440n
M60 N026 N023 N003 N015 PMOS l=180n w=440n
C6 N026 0 1fF
V4 N014 0 1.8V
M61 N014 A3 N030 N014 PMOS l=180n w=880n
M62 N030 A3 0 0 NMOS l=180n w=440n
M63 N014 N008 N034 N014 PMOS l=180n w=880n
M64 N034 N008 0 0 NMOS l=180n w=440n
M65 N014 N026 N038 N014 PMOS l=180n w=880n
M66 N038 N026 0 0 NMOS l=180n w=440n
M67 N008 N030 N022 0 NMOS l=180n w=440n
M68 N022 A3 N008 N014 PMOS l=180n w=440n
M69 N034 A3 N022 0 NMOS l=180n w=440n
M70 N022 N030 N034 N014 PMOS l=180n w=440n
M71 N014 N022 N018 N014 PMOS l=180n w=880n
M72 N018 N022 0 0 NMOS l=180n w=440n
M73 N026 N018 S3 0 NMOS l=180n w=440n
M74 S3 N022 N026 N014 PMOS l=180n w=440n
M75 N038 N022 S3 0 NMOS l=180n w=440n
M76 S3 N018 N038 N014 PMOS l=180n w=440n
C7 S3 0 1fF
M77 N026 N022 N029 0 NMOS l=180n w=440n
M78 N029 N018 N026 N014 PMOS l=180n w=440n
M79 N008 N018 N029 0 NMOS l=180n w=440n
M80 N029 N022 N008 N014 PMOS l=180n w=440n
C8 N029 0 1fF
M81 N002 Ctrl N001 N002 PMOS l=180n w=880n
M82 N001 Ctrl 0 0 NMOS l=180n w=440n
M83 N002 B0 N013 N002 PMOS l=180n w=880n
M84 N013 B0 0 0 NMOS l=180n w=440n
V5 N002 0 1.8V
M85 B1 N001 N005 0 NMOS l=180n w=440n
M86 N005 Ctrl B1 N002 PMOS l=180n w=440n
M87 N011 Ctrl N005 0 NMOS l=180n w=440n
M88 N005 N001 N011 N002 PMOS l=180n w=440n
M89 N007 B1 N011 N007 PMOS l=180n w=880n
M90 N011 B1 0 0 NMOS l=180n w=440n
V6 N007 0 1.8V
M91 B2 N001 N003 0 NMOS l=180n w=440n
M92 N003 Ctrl B2 N002 PMOS l=180n w=440n
M93 N010 Ctrl N003 0 NMOS l=180n w=440n
M94 N003 N001 N010 N002 PMOS l=180n w=440n
M95 N006 B2 N010 N006 PMOS l=180n w=880n
M96 N010 B2 0 0 NMOS l=180n w=440n
V7 N006 0 1.8V
M97 B3 N001 N008 0 NMOS l=180n w=440n
M98 N008 Ctrl B3 N002 PMOS l=180n w=440n
M99 N012 Ctrl N008 0 NMOS l=180n w=440n
M100 N008 N001 N012 N002 PMOS l=180n w=440n
M101 N009 B3 N012 N009 PMOS l=180n w=880n
M102 N012 B3 0 0 NMOS l=180n w=440n
V8 N009 0 1.8V
M103 B0 N001 N004 0 NMOS l=180n w=440n
M104 N004 Ctrl B0 N002 PMOS l=180n w=440n
M105 N013 Ctrl N004 0 NMOS l=180n w=440n
M106 N004 N001 N013 N002 PMOS l=180n w=440n
* -A
* -B
* -C
* A
* B
* C
* B
* -A
* A
* -B
* A
* A[xor]B
* -(A[xor]B)
* -(A[xor]B)
* A[xor]B
* A[xor]B
* C
* S0
* C
* -(A[xor]B)
* -(A[xor]B)
* A[xor]B
* B
* C_out
* XOR(AB)
* -A
* -B
* -C
* A
* B
* C
* B
* -A
* A
* -B
* A
* A[xor]B
* -(A[xor]B)
* -(A[xor]B)
* A[xor]B
* A[xor]B
* C
* S1
* C
* -(A[xor]B)
* -(A[xor]B)
* A[xor]B
* B
* C_out
* XOR(AB)
* -A
* -B
* -C
* A
* B
* C
* B
* -A
* A
* -B
* A
* A[xor]B
* -(A[xor]B)
* -(A[xor]B)
* A[xor]B
* A[xor]B
* C
* S2
* C
* -(A[xor]B)
* -(A[xor]B)
* A[xor]B
* B
* C_out
* XOR(AB)
* -A
* -B
* -C
* A
* B
* C
* B
* -A
* A
* -B
* A
* A[xor]B
* -(A[xor]B)
* -(A[xor]B)
* A[xor]B
* A[xor]B
* C
* S3
* C
* -(A[xor]B)
* -(A[xor]B)
* A[xor]B
* B
* C_out
* XOR(AB)
* -Ctrl
* -B
* Ctrl
* B0
* A0
* B
* -Ctrl
* Ctrl
* -B
* Ctrl
* -B
* B1
* A1
* B
* -Ctrl
* Ctrl
* -B
* Ctrl
* -B
* B2
* A2
* B
* -Ctrl
* Ctrl
* -B
* Ctrl
* -B
* A3
* B3
* B
* -Ctrl
* -B
* Ctrl
* Ctrl
* Adder/Subtractor
* X Memory
* X0
* X1
* X2
* X3
* LOT: n94s                  WAF: 08
* Temperature_parameters=Default
.MODEL nmos nmos LEVEL = 8
+VERSION = 3.1            TNOM    = 27             TOX     = 5.8E-9
+XJ      = 1E-7           NCH     = 2.3549E17      VTH0    = 0.4308936
+K1      = 0.3519429      K2      = 0.0298493      K3      = 1E-3
+K3B     = 0.0592323      W0      = 1E-5           NLX     = 1.465901E-7
+DVT0W   = 0              DVT1W   = 0              DVT2W   = 0
+DVT0    = 0.0183405      DVT1    = 4.897584E-3    DVT2    = -0.0252658
+U0      = 455.3033362    UA      = 5.223592E-10   UB      = 1.104713E-18
+UC      = 3.287888E-11   VSAT    = 1.050993E5     A0      = 1.2318623
+AGS     = 0.3043334      B0      = 6.67749E-8     B1      = 5E-6
+KETA    = 8.518046E-4    A1      = 0              A2      = 1
+RDSW    = 509.5675851    PRWG    = 0.0227558      PRWB    = -1E-3
+WR      = 1              WINT    = 2.126497E-9    LINT    = 4.393474E-9
+XL      = -3E-8          XW      = 0              DWG     = -3.409033E-9
+DWB     = 2.794842E-9    VOFF    = -0.1026054     NFACTOR = 0.1344887
+CIT     = 0              CDSC    = 1.527511E-3    CDSCD   = 0
+CDSCB   = 0              ETA0    = 3.48737E-3     ETAB    = 4.557986E-4
+DSUB    = 3.045473E-3    PCLM    = 1.0446257      PDIBLC1 = 0.1441952
+PDIBLC2 = 4.513382E-4    PDIBLCB = -2.816756E-5   DROUT   = 0.4698725
+PSCBE1  = 1.761109E10    PSCBE2  = 3.772916E-9    PVAG    = 0.0361824
+DELTA   = 0.01           MOBMOD  = 1              PRT     = 0
+UTE     = -1.5           KT1     = -0.11          KT1L    = 0
+KT2     = 0.022          UA1     = 4.31E-9        UB1     = -7.61E-18
+UC1     = -5.6E-11       AT      = 3.3E4          WL      = 0
+WLN     = 1              WW      = 0              WWN     = 1
+WWL     = 0              LL      = 0              LLN     = 1
+LW      = 0              LWN     = 1              LWL     = 0
+CAPMOD  = 2              XPART   = 0.4            CGDO    = 6.27E-10
+CGSO    = 6.27E-10       CGBO    = 0              CJ      = 1.918655E-3
+PB      = 0.9784049      MJ      = 0.4721729      CJSW    = 4.441595E-10
+PBSW    = 0.9419636      MJSW    = 0.2871118      PVTH0   = 1.342985E-3
+PRDSW   = -61.8357222    PK2     = -3.140724E-3   WKETA   = 7.512693E-4
+LKETA   = -6.144062E-3
* LOT: n94s                  WAF: 08
* Temperature_parameters=Default
.MODEL pmos pmos LEVEL = 8
+VERSION = 3.1            TNOM    = 27             TOX     = 5.8E-9
+XJ      = 1E-7           NCH     = 4.1589E17      VTH0    = -0.6158735
+K1      = 0.4598379      K2      = 0.0399415      K3      = 0
+K3B     = 8.7410723      W0      = 1E-6           NLX     = 1E-9
+DVT0W   = 0              DVT1W   = 0              DVT2W   = 0
+DVT0    = 0.6249485      DVT1    = 0.203296       DVT2    = -0.0513763
+U0      = 158.67524      UA      = 2.200024E-10   UB      = 4.457415E-18
+UC      = 1.02138E-10    VSAT    = 1.85064E5      A0      = 1.3826397
+AGS     = 0.4192977      B0      = 2.844099E-6    B1      = 5E-6
+KETA    = 0.0208695      A1      = 0              A2      = 1
+RDSW    = 968.5463       PRWG    = -0.1026483     PRWB    = -0.325
+WR      = 1              WINT    = 2.748811E-8    LINT    = 8.71907E-9
+XL      = -3E-8          XW      = 0              DWG     = -4.087585E-8
+DWB     = 2.032008E-8    VOFF    = -0.15          NFACTOR = 1.5460516
+CIT     = 0              CDSC    = 1.413317E-4    CDSCD   = 0
+CDSCB   = 0              ETA0    = 0.3241245      ETAB    = -0.1842
+DSUB    = 1.0287138      PCLM    = 5.2654567      PDIBLC1 = 4.228338E-3
+PDIBLC2 = 1.204519E-3    PDIBLCB = 2.37525E-3     DROUT   = 0
+PSCBE1  = 3.011456E10    PSCBE2  = 3.037042E-7    PVAG    = 8.9564294
+DELTA   = 0.01           MOBMOD  = 1              PRT     = 0
+UTE     = -1.5           KT1     = -0.11          KT1L    = 0
+KT2     = 0.022          UA1     = 4.31E-9        UB1     = -7.61E-18
+UC1     = -5.6E-11       AT      = 3.3E4          WL      = 0
+WLN     = 1              WW      = 0              WWN     = 1
+WWL     = 0              LL      = 0              LLN     = 1
+LW      = 0              LWN     = 1              LWL     = 0
+CAPMOD  = 2              XPART   = 0.4            CGDO    = 5.59E-10
+CGSO    = 5.59E-10       CGBO    = 0              CJ      = 1.882857E-3
+PB      = 0.9891317      MJ      = 0.4679789      CJSW    = 3.67186E-10
+PBSW    = 0.9884654      MJSW    = 0.3562128      PVTH0   = 3.923756E-3
+PRDSW   = 15.3953053     PK2     = 2.061759E-3    WKETA   = 4.10049E-3
+LKETA   = -0.0232426     LVSAT   = 1.257E5
.ends adder_subtractor

.subckt logic_circuit_multiply C0 C1 C2 C3 Multiplier X0 X1 X2 X3 C0_O C1_O C2_O C3_O X0_O X1_O X2_O X3_O
M1 N001 X0 N003 N001 PMOS l=180n w=880n
M2 N001 Multiplier N003 N001 PMOS l=180n w=880n
M3 N003 X0 N005 0 NMOS l=180n w=880n
M4 N005 Multiplier 0 0 NMOS l=180n w=880n
M5 N001 N003 X0_O N001 PMOS l=180n w=880n
M6 X0_O N003 0 0 NMOS l=180n w=440n
V1 N001 0 1.8V
M7 N002 X2 N004 N002 PMOS l=180n w=880n
M8 N002 Multiplier N004 N002 PMOS l=180n w=880n
M9 N004 X2 N006 0 NMOS l=180n w=880n
M10 N006 Multiplier 0 0 NMOS l=180n w=880n
M11 N002 N004 X2_O N002 PMOS l=180n w=880n
M12 X2_O N004 0 0 NMOS l=180n w=440n
V2 N002 0 1.8V
M13 N007 X1 N009 N007 PMOS l=180n w=880n
M14 N007 Multiplier N009 N007 PMOS l=180n w=880n
M15 N009 X1 N011 0 NMOS l=180n w=880n
M16 N011 Multiplier 0 0 NMOS l=180n w=880n
M17 N007 N009 X1_O N007 PMOS l=180n w=880n
M18 X1_O N009 0 0 NMOS l=180n w=440n
V3 N007 0 1.8V
M19 N008 X3 N010 N008 PMOS l=180n w=880n
M20 N008 Multiplier N010 N008 PMOS l=180n w=880n
M21 N010 X3 N012 0 NMOS l=180n w=880n
M22 N012 Multiplier 0 0 NMOS l=180n w=880n
M23 N008 N010 X3_O N008 PMOS l=180n w=880n
M24 X3_O N010 0 0 NMOS l=180n w=440n
V4 N008 0 1.8V
M25 N013 C0 N015 N013 PMOS l=180n w=880n
M26 N013 Multiplier N015 N013 PMOS l=180n w=880n
M27 N015 C0 N017 0 NMOS l=180n w=880n
M28 N017 Multiplier 0 0 NMOS l=180n w=880n
M29 N013 N015 C0_O N013 PMOS l=180n w=880n
M30 C0_O N015 0 0 NMOS l=180n w=440n
V5 N013 0 1.8V
M31 N014 C2 N016 N014 PMOS l=180n w=880n
M32 N014 Multiplier N016 N014 PMOS l=180n w=880n
M33 N016 C2 N018 0 NMOS l=180n w=880n
M34 N018 Multiplier 0 0 NMOS l=180n w=880n
M35 N014 N016 C2_O N014 PMOS l=180n w=880n
M36 C2_O N016 0 0 NMOS l=180n w=440n
V6 N014 0 1.8V
M37 N019 C1 N021 N019 PMOS l=180n w=880n
M38 N019 Multiplier N021 N019 PMOS l=180n w=880n
M39 N021 C1 N023 0 NMOS l=180n w=880n
M40 N023 Multiplier 0 0 NMOS l=180n w=880n
M41 N019 N021 C1_O N019 PMOS l=180n w=880n
M42 C1_O N021 0 0 NMOS l=180n w=440n
V7 N019 0 1.8V
M43 N020 C3 N022 N020 PMOS l=180n w=880n
M44 N020 Multiplier N022 N020 PMOS l=180n w=880n
M45 N022 C3 N024 0 NMOS l=180n w=880n
M46 N024 Multiplier 0 0 NMOS l=180n w=880n
M47 N020 N022 C3_O N020 PMOS l=180n w=880n
M48 C3_O N022 0 0 NMOS l=180n w=440n
V8 N020 0 1.8V
* A0
* B0
* A1
* B1
* A2
* A3
* B2
* B3
* Multiplier
* Multiplier
* Multiplier
* Multiplier
* Multiplier
* Multiplier
* Multiplier
* Multiplier
* C0
* C1
* X0
* X1
* X2
* X3
* C2
* C3
* X0
* X2
* X3
* X1
* C0
* C2
* C1
* C3
* LOT: n94s                  WAF: 08
* Temperature_parameters=Default
.MODEL nmos nmos LEVEL = 8
+VERSION = 3.1            TNOM    = 27             TOX     = 5.8E-9
+XJ      = 1E-7           NCH     = 2.3549E17      VTH0    = 0.4308936
+K1      = 0.3519429      K2      = 0.0298493      K3      = 1E-3
+K3B     = 0.0592323      W0      = 1E-5           NLX     = 1.465901E-7
+DVT0W   = 0              DVT1W   = 0              DVT2W   = 0
+DVT0    = 0.0183405      DVT1    = 4.897584E-3    DVT2    = -0.0252658
+U0      = 455.3033362    UA      = 5.223592E-10   UB      = 1.104713E-18
+UC      = 3.287888E-11   VSAT    = 1.050993E5     A0      = 1.2318623
+AGS     = 0.3043334      B0      = 6.67749E-8     B1      = 5E-6
+KETA    = 8.518046E-4    A1      = 0              A2      = 1
+RDSW    = 509.5675851    PRWG    = 0.0227558      PRWB    = -1E-3
+WR      = 1              WINT    = 2.126497E-9    LINT    = 4.393474E-9
+XL      = -3E-8          XW      = 0              DWG     = -3.409033E-9
+DWB     = 2.794842E-9    VOFF    = -0.1026054     NFACTOR = 0.1344887
+CIT     = 0              CDSC    = 1.527511E-3    CDSCD   = 0
+CDSCB   = 0              ETA0    = 3.48737E-3     ETAB    = 4.557986E-4
+DSUB    = 3.045473E-3    PCLM    = 1.0446257      PDIBLC1 = 0.1441952
+PDIBLC2 = 4.513382E-4    PDIBLCB = -2.816756E-5   DROUT   = 0.4698725
+PSCBE1  = 1.761109E10    PSCBE2  = 3.772916E-9    PVAG    = 0.0361824
+DELTA   = 0.01           MOBMOD  = 1              PRT     = 0
+UTE     = -1.5           KT1     = -0.11          KT1L    = 0
+KT2     = 0.022          UA1     = 4.31E-9        UB1     = -7.61E-18
+UC1     = -5.6E-11       AT      = 3.3E4          WL      = 0
+WLN     = 1              WW      = 0              WWN     = 1
+WWL     = 0              LL      = 0              LLN     = 1
+LW      = 0              LWN     = 1              LWL     = 0
+CAPMOD  = 2              XPART   = 0.4            CGDO    = 6.27E-10
+CGSO    = 6.27E-10       CGBO    = 0              CJ      = 1.918655E-3
+PB      = 0.9784049      MJ      = 0.4721729      CJSW    = 4.441595E-10
+PBSW    = 0.9419636      MJSW    = 0.2871118      PVTH0   = 1.342985E-3
+PRDSW   = -61.8357222    PK2     = -3.140724E-3   WKETA   = 7.512693E-4
+LKETA   = -6.144062E-3
* LOT: n94s                  WAF: 08
* Temperature_parameters=Default
.MODEL pmos pmos LEVEL = 8
+VERSION = 3.1            TNOM    = 27             TOX     = 5.8E-9
+XJ      = 1E-7           NCH     = 4.1589E17      VTH0    = -0.6158735
+K1      = 0.4598379      K2      = 0.0399415      K3      = 0
+K3B     = 8.7410723      W0      = 1E-6           NLX     = 1E-9
+DVT0W   = 0              DVT1W   = 0              DVT2W   = 0
+DVT0    = 0.6249485      DVT1    = 0.203296       DVT2    = -0.0513763
+U0      = 158.67524      UA      = 2.200024E-10   UB      = 4.457415E-18
+UC      = 1.02138E-10    VSAT    = 1.85064E5      A0      = 1.3826397
+AGS     = 0.4192977      B0      = 2.844099E-6    B1      = 5E-6
+KETA    = 0.0208695      A1      = 0              A2      = 1
+RDSW    = 968.5463       PRWG    = -0.1026483     PRWB    = -0.325
+WR      = 1              WINT    = 2.748811E-8    LINT    = 8.71907E-9
+XL      = -3E-8          XW      = 0              DWG     = -4.087585E-8
+DWB     = 2.032008E-8    VOFF    = -0.15          NFACTOR = 1.5460516
+CIT     = 0              CDSC    = 1.413317E-4    CDSCD   = 0
+CDSCB   = 0              ETA0    = 0.3241245      ETAB    = -0.1842
+DSUB    = 1.0287138      PCLM    = 5.2654567      PDIBLC1 = 4.228338E-3
+PDIBLC2 = 1.204519E-3    PDIBLCB = 2.37525E-3     DROUT   = 0
+PSCBE1  = 3.011456E10    PSCBE2  = 3.037042E-7    PVAG    = 8.9564294
+DELTA   = 0.01           MOBMOD  = 1              PRT     = 0
+UTE     = -1.5           KT1     = -0.11          KT1L    = 0
+KT2     = 0.022          UA1     = 4.31E-9        UB1     = -7.61E-18
+UC1     = -5.6E-11       AT      = 3.3E4          WL      = 0
+WLN     = 1              WW      = 0              WWN     = 1
+WWL     = 0              LL      = 0              LLN     = 1
+LW      = 0              LWN     = 1              LWL     = 0
+CAPMOD  = 2              XPART   = 0.4            CGDO    = 5.59E-10
+CGSO    = 5.59E-10       CGBO    = 0              CJ      = 1.882857E-3
+PB      = 0.9891317      MJ      = 0.4679789      CJSW    = 3.67186E-10
+PBSW    = 0.9884654      MJSW    = 0.3562128      PVTH0   = 3.923756E-3
+PRDSW   = 15.3953053     PK2     = 2.061759E-3    WKETA   = 4.10049E-3
+LKETA   = -0.0232426     LVSAT   = 1.257E5
.ends logic_circuit_multiply

.subckt multiplier C0 C1 C2 C3 X0 X1 X2 X3 P0 P1 P2 P3 P4 P5 P6 P7
V1 N026 0 1.8V
M1 N026 N006 N037 N026 PMOS l=180n w=880n
M2 N037 N006 0 0 NMOS l=180n w=440n
M3 N026 N018 N044 N026 PMOS l=180n w=880n
M4 N044 N018 0 0 NMOS l=180n w=440n
M5 N018 N037 P1 0 NMOS l=180n w=440n
M6 P1 N006 N018 N026 PMOS l=180n w=440n
M7 N044 N006 P1 0 NMOS l=180n w=440n
M8 P1 N037 N044 N026 PMOS l=180n w=440n
C1 N033 0 1fF
C2 P1 0 1fF
M9 N026 N037 N047 N026 PMOS l=180n w=1760n
M10 N047 N044 N033 N026 PMOS l=180n w=1760n
M11 N033 N037 0 0 NMOS l=180n w=440n
M12 N033 N044 0 0 NMOS l=180n w=440n
M13 N001 X0 N003 N001 PMOS l=180n w=880n
M14 N001 C0 N003 N001 PMOS l=180n w=880n
M15 N003 X0 N010 0 NMOS l=180n w=880n
M16 N010 C0 0 0 NMOS l=180n w=880n
M17 N001 N003 P0 N001 PMOS l=180n w=880n
M18 P0 N003 0 0 NMOS l=180n w=440n
V2 N001 0 1.8V
C3 P0 0 1fF
M19 N001 X1 N002 N001 PMOS l=180n w=880n
M20 N001 C0 N002 N001 PMOS l=180n w=880n
M21 N002 X1 N009 0 NMOS l=180n w=880n
M22 N009 C0 0 0 NMOS l=180n w=880n
M23 N001 N002 N006 N001 PMOS l=180n w=880n
M24 N006 N002 0 0 NMOS l=180n w=440n
M25 N013 X0 N014 N013 PMOS l=180n w=880n
M26 N013 C1 N014 N013 PMOS l=180n w=880n
M27 N014 X0 N021 0 NMOS l=180n w=880n
M28 N021 C1 0 0 NMOS l=180n w=880n
M29 N013 N014 N018 N013 PMOS l=180n w=880n
M30 N018 N014 0 0 NMOS l=180n w=440n
V3 N013 0 1.8V
V4 N025 0 1.8V
M31 N025 N008 N036 N025 PMOS l=180n w=880n
M32 N036 N008 0 0 NMOS l=180n w=440n
M33 N025 N019 N043 N025 PMOS l=180n w=880n
M34 N043 N019 0 0 NMOS l=180n w=440n
M35 N025 N033 N050 N025 PMOS l=180n w=880n
M36 N050 N033 0 0 NMOS l=180n w=440n
M37 N019 N036 N031 0 NMOS l=180n w=440n
M38 N031 N008 N019 N025 PMOS l=180n w=440n
M39 N043 N008 N031 0 NMOS l=180n w=440n
M40 N031 N036 N043 N025 PMOS l=180n w=440n
M41 N025 N031 N029 N025 PMOS l=180n w=880n
M42 N029 N031 0 0 NMOS l=180n w=440n
M43 N033 N029 N041 0 NMOS l=180n w=440n
M44 N041 N031 N033 N025 PMOS l=180n w=440n
M45 N050 N031 N041 0 NMOS l=180n w=440n
M46 N041 N029 N050 N025 PMOS l=180n w=440n
C4 N041 0 1fF
M47 N033 N031 N034 0 NMOS l=180n w=440n
M48 N034 N029 N033 N025 PMOS l=180n w=440n
M49 N019 N029 N034 0 NMOS l=180n w=440n
M50 N034 N031 N019 N025 PMOS l=180n w=440n
C5 N034 0 1fF
M51 N001 X2 N005 N001 PMOS l=180n w=880n
M52 N001 C0 N005 N001 PMOS l=180n w=880n
M53 N005 X2 N012 0 NMOS l=180n w=880n
M54 N012 C0 0 0 NMOS l=180n w=880n
M55 N001 N005 N008 N001 PMOS l=180n w=880n
M56 N008 N005 0 0 NMOS l=180n w=440n
M57 N013 X1 N017 N013 PMOS l=180n w=880n
M58 N013 C1 N017 N013 PMOS l=180n w=880n
M59 N017 X1 N024 0 NMOS l=180n w=880n
M60 N024 C1 0 0 NMOS l=180n w=880n
M61 N013 N017 N019 N013 PMOS l=180n w=880n
M62 N019 N017 0 0 NMOS l=180n w=440n
V5 N027 0 1.8V
M63 N027 N007 N038 N027 PMOS l=180n w=880n
M64 N038 N007 0 0 NMOS l=180n w=440n
M65 N027 N020 N045 N027 PMOS l=180n w=880n
M66 N045 N020 0 0 NMOS l=180n w=440n
M67 N027 N034 N051 N027 PMOS l=180n w=880n
M68 N051 N034 0 0 NMOS l=180n w=440n
M69 N020 N038 N032 0 NMOS l=180n w=440n
M70 N032 N007 N020 N027 PMOS l=180n w=440n
M71 N045 N007 N032 0 NMOS l=180n w=440n
M72 N032 N038 N045 N027 PMOS l=180n w=440n
M73 N027 N032 N030 N027 PMOS l=180n w=880n
M74 N030 N032 0 0 NMOS l=180n w=440n
M75 N034 N030 N042 0 NMOS l=180n w=440n
M76 N042 N032 N034 N027 PMOS l=180n w=440n
M77 N051 N032 N042 0 NMOS l=180n w=440n
M78 N042 N030 N051 N027 PMOS l=180n w=440n
C6 N042 0 1fF
M79 N034 N032 N035 0 NMOS l=180n w=440n
M80 N035 N030 N034 N027 PMOS l=180n w=440n
M81 N020 N030 N035 0 NMOS l=180n w=440n
M82 N035 N032 N020 N027 PMOS l=180n w=440n
C7 N035 0 1fF
M83 N001 X3 N004 N001 PMOS l=180n w=880n
M84 N001 C0 N004 N001 PMOS l=180n w=880n
M85 N004 X3 N011 0 NMOS l=180n w=880n